# Altium project DSP_FPGA_BOTTOM.PrjPcb (part 1 of 2)
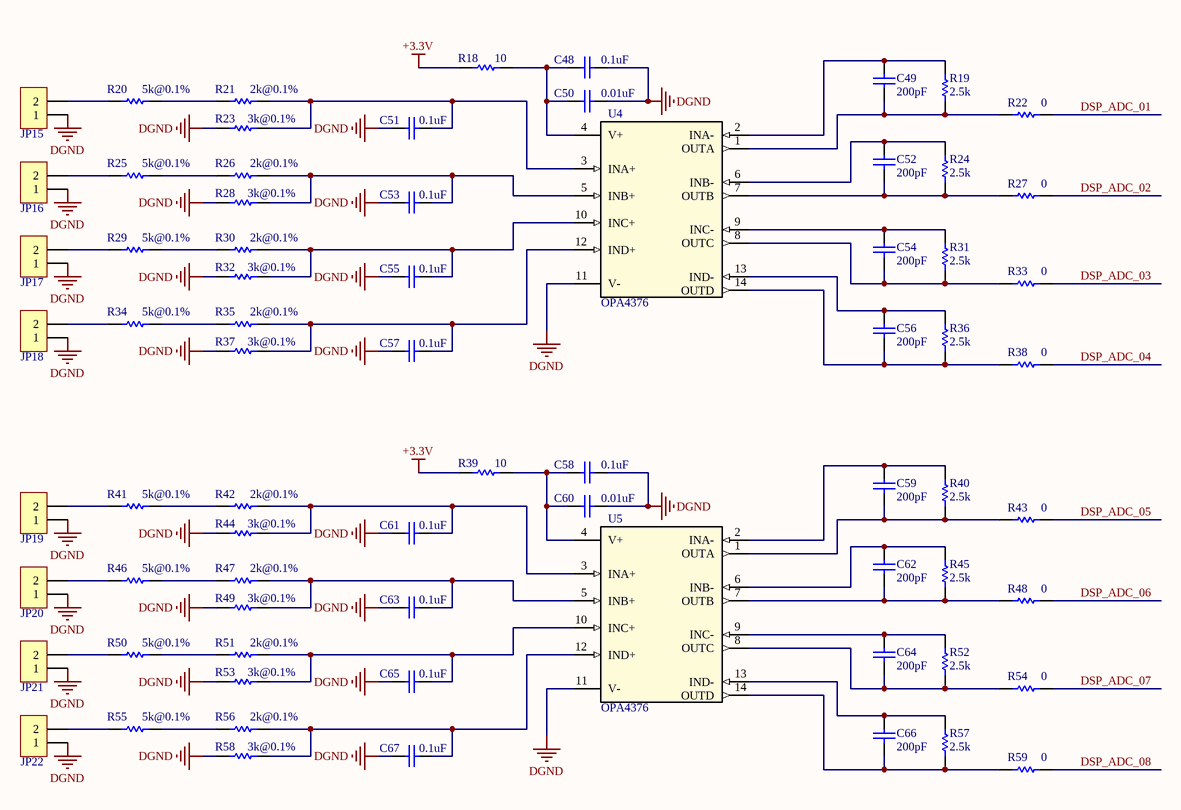
[diagram p0: ADC.SchDoc]
17 sheets, 649 parts. Net scope: global (net labels, ports and power ports of the same name join across sheets).
Board file: DSP_FPGA.PcbDoc
Sheets:
  ADC.SchDoc
  Communication_Part1.SchDoc
  Communication_Part2.SchDoc
  DAC.SchDoc
  DSP_GPIO_Part1.SchDoc
  DSP_GPIO_Part2.SchDoc
  DSP_GPIO_Part3.SchDoc
  DSP_GPIO_Part4.SchDoc
  Enconder_Part1.SchDoc
  Enconder_Part2.SchDoc
  Enconder_Part3.SchDoc
  FPGA_GPIO_Part1.SchDoc
  Header.SchDoc
  Interface_DSP_FPGA.SchDoc
  Power.SchDoc
  PWM_PULSE.SchDoc
  PWM_WIDTH.SchDoc

## Sheet ADC.SchDoc
size A4

### Parts
C48  value 0.1uF  [1608[0603]]  (hidden comment: Cap)
C49  value 200pF  [1608[0603]]  (hidden comment: Cap)
C50  value 0.01uF  [1608[0603]]  (hidden comment: Cap)
C51  value 0.1uF  [1608[0603]]  (hidden comment: Cap)
C52  value 200pF  [1608[0603]]  (hidden comment: Cap)
C53  value 0.1uF  [1608[0603]]  (hidden comment: Cap)
C54  value 200pF  [1608[0603]]  (hidden comment: Cap)
C55  value 0.1uF  [1608[0603]]  (hidden comment: Cap)
C56  value 200pF  [1608[0603]]  (hidden comment: Cap)
C57  value 0.1uF  [1608[0603]]  (hidden comment: Cap)
C58  value 0.1uF  [1608[0603]]  (hidden comment: Cap)
C59  value 200pF  [1608[0603]]  (hidden comment: Cap)
C60  value 0.01uF  [1608[0603]]  (hidden comment: Cap)
C61  value 0.1uF  [1608[0603]]  (hidden comment: Cap)
C62  value 200pF  [1608[0603]]  (hidden comment: Cap)
C63  value 0.1uF  [1608[0603]]  (hidden comment: Cap)
C64  value 200pF  [1608[0603]]  (hidden comment: Cap)
C65  value 0.1uF  [1608[0603]]  (hidden comment: Cap)
C66  value 200pF  [1608[0603]]  (hidden comment: Cap)
C67  value 0.1uF  [1608[0603]]  (hidden comment: Cap)
JP15  HDR-1X2  [MX 1.25-WI-2P]  (value not drawn)
JP16  HDR-1X2  [MX 1.25-WI-2P]  (value not drawn)
JP17  HDR-1X2  [MX 1.25-WI-2P]  (value not drawn)
JP18  HDR-1X2  [MX 1.25-WI-2P]  (value not drawn)
JP19  HDR-1X2  [MX 1.25-WI-2P]  (value not drawn)
JP20  HDR-1X2  [MX 1.25-WI-2P]  (value not drawn)
JP21  HDR-1X2  [MX 1.25-WI-2P]  (value not drawn)
JP22  HDR-1X2  [MX 1.25-WI-2P]  (value not drawn)
R18  value 10  [1608[0603]]  (hidden comment: Res1)
R19  value 2.5k  [1608[0603]]  (hidden comment: Res1)
R20  value 5k@0.1%  [1608[0603]]  (hidden comment: Res1)
R21  value 2k@0.1%  [1608[0603]]  (hidden comment: Res1)
R22  value 0  [1608[0603]]  (hidden comment: Res1)
R23  value 3k@0.1%  [1608[0603]]  (hidden comment: Res1)
R24  value 2.5k  [1608[0603]]  (hidden comment: Res1)
R25  value 5k@0.1%  [1608[0603]]  (hidden comment: Res1)
R26  value 2k@0.1%  [1608[0603]]  (hidden comment: Res1)
R27  value 0  [1608[0603]]  (hidden comment: Res1)
R28  value 3k@0.1%  [1608[0603]]  (hidden comment: Res1)
R29  value 5k@0.1%  [1608[0603]]  (hidden comment: Res1)
R30  value 2k@0.1%  [1608[0603]]  (hidden comment: Res1)
R31  value 2.5k  [1608[0603]]  (hidden comment: Res1)
R32  value 3k@0.1%  [1608[0603]]  (hidden comment: Res1)
R33  value 0  [1608[0603]]  (hidden comment: Res1)
R34  value 5k@0.1%  [1608[0603]]  (hidden comment: Res1)
R35  value 2k@0.1%  [1608[0603]]  (hidden comment: Res1)
R36  value 2.5k  [1608[0603]]  (hidden comment: Res1)
R37  value 3k@0.1%  [1608[0603]]  (hidden comment: Res1)
R38  value 0  [1608[0603]]  (hidden comment: Res1)
R39  value 10  [1608[0603]]  (hidden comment: Res1)
R40  value 2.5k  [1608[0603]]  (hidden comment: Res1)
R41  value 5k@0.1%  [1608[0603]]  (hidden comment: Res1)
R42  value 2k@0.1%  [1608[0603]]  (hidden comment: Res1)
R43  value 0  [1608[0603]]  (hidden comment: Res1)
R44  value 3k@0.1%  [1608[0603]]  (hidden comment: Res1)
R45  value 2.5k  [1608[0603]]  (hidden comment: Res1)
R46  value 5k@0.1%  [1608[0603]]  (hidden comment: Res1)
R47  value 2k@0.1%  [1608[0603]]  (hidden comment: Res1)
R48  value 0  [1608[0603]]  (hidden comment: Res1)
R49  value 3k@0.1%  [1608[0603]]  (hidden comment: Res1)
R50  value 5k@0.1%  [1608[0603]]  (hidden comment: Res1)
R51  value 2k@0.1%  [1608[0603]]  (hidden comment: Res1)
R52  value 2.5k  [1608[0603]]  (hidden comment: Res1)
R53  value 3k@0.1%  [1608[0603]]  (hidden comment: Res1)
R54  value 0  [1608[0603]]  (hidden comment: Res1)
R55  value 5k@0.1%  [1608[0603]]  (hidden comment: Res1)
R56  value 2k@0.1%  [1608[0603]]  (hidden comment: Res1)
R57  value 2.5k  [1608[0603]]  (hidden comment: Res1)
R58  value 3k@0.1%  [1608[0603]]  (hidden comment: Res1)
R59  value 0  [1608[0603]]  (hidden comment: Res1)
U4  OPA4376  [OPA4376_TSSOP]
U5  OPA4376  [OPA4376_TSSOP]

### Nets
+3.3V: R18.2 R39.2
DGND: C48.2 C50.2 C51.1 C53.1 C55.1 C57.1 C58.2 C60.2 C61.1 C63.1 C65.1 C67.1 JP15.1 JP16.1 JP17.1 JP18.1 JP19.1 JP20.1 JP21.1 JP22.1 R23.2 R28.2 R32.2 R37.2 R44.2 R49.2 R53.2 R58.2 U4.11(V-) U5.11(V-)
DSP_ADC_01: R22.2
DSP_ADC_02: R27.2
DSP_ADC_03: R33.2
DSP_ADC_04: R38.2
DSP_ADC_05: R43.2
DSP_ADC_06: R48.2
DSP_ADC_07: R54.2
DSP_ADC_08: R59.2
NetC48_1: C48.1 C50.1 R18.1 U4.4(V+)
NetC49_1: C49.1 R19.2 U4.2(INA-)
NetC49_2: C49.2 R19.1 R22.1 U4.1(OUTA)
NetC51_2: C51.2 R21.1 R23.1 U4.3(INA+)
NetC52_1: C52.1 R24.2 U4.6(INB-)
NetC52_2: C52.2 R24.1 R27.1 U4.7(OUTB)
NetC53_2: C53.2 R26.1 R28.1 U4.5(INB+)
NetC54_1: C54.1 R31.2 U4.9(INC-)
NetC54_2: C54.2 R31.1 R33.1 U4.8(OUTC)
NetC55_2: C55.2 R30.1 R32.1 U4.10(INC+)
NetC56_1: C56.1 R36.2 U4.13(IND-)
NetC56_2: C56.2 R36.1 R38.1 U4.14(OUTD)
NetC57_2: C57.2 R35.1 R37.1 U4.12(IND+)
NetC58_1: C58.1 C60.1 R39.1 U5.4(V+)
NetC59_1: C59.1 R40.2 U5.2(INA-)
NetC59_2: C59.2 R40.1 R43.1 U5.1(OUTA)
NetC61_2: C61.2 R42.1 R44.1 U5.3(INA+)
NetC62_1: C62.1 R45.2 U5.6(INB-)
NetC62_2: C62.2 R45.1 R48.1 U5.7(OUTB)
NetC63_2: C63.2 R47.1 R49.1 U5.5(INB+)
NetC64_1: C64.1 R52.2 U5.9(INC-)
NetC64_2: C64.2 R52.1 R54.1 U5.8(OUTC)
NetC65_2: C65.2 R51.1 R53.1 U5.10(INC+)
NetC66_1: C66.1 R57.2 U5.13(IND-)
NetC66_2: C66.2 R57.1 R59.1 U5.14(OUTD)
NetC67_2: C67.2 R56.1 R58.1 U5.12(IND+)
NetJP15_2: JP15.2 R20.2
NetJP16_2: JP16.2 R25.2
NetJP17_2: JP17.2 R29.2
NetJP18_2: JP18.2 R34.2
NetJP19_2: JP19.2 R41.2
NetJP20_2: JP20.2 R46.2
NetJP21_2: JP21.2 R50.2
NetJP22_2: JP22.2 R55.2
NetR20_1: R20.1 R21.2
NetR25_1: R25.1 R26.2
NetR29_1: R29.1 R30.2
NetR34_1: R34.1 R35.2
NetR41_1: R41.1 R42.2
NetR46_1: R46.1 R47.2
NetR50_1: R50.1 R51.2
NetR55_1: R55.1 R56.2

### Library data of the parts
C48-C67 = Cap: Capacitor; Published: 8-Jun-2000; LatestRevisionDate: 17-Jul-2002; LatestRevisionNote: Re-released for DXP Platform.; PackageReference: RAD-0.3; Publisher: Altium Limited; PackageDescription: Radial Cap, Thru-Hole; 2 Leads; 0.3 in Pin Spacing
JP15-JP22 = Header 2: 2P接插件; 版权归属: 源创客; BOM名称: 2P接插件; 学习资源: www.ooocke.com
R18-R59 = Res1: Resistor; Published: 8-Jun-2000; LatestRevisionDate: 17-Jul-2002; LatestRevisionNote: Re-released for DXP Platform.; PackageReference: AXIAL-0.3; Publisher: Altium Limited; PackageDescription: Axial Device, Thru-Hole; 2 Leads; 0.3 in Pin Spacing
U4 U5 = OPA4376: Manufacturer: Texas Instruments; Manufacturer_Part_Number: opa4376_pw_14; INDUSTRY_STD_PKG_TYPE: TSSOP; FAMILY_NAME: LOW OFFSET VOLTAGE; PIN_COUNT: 14; PACKAGE_DESIGNATOR: PW; Datasheet_URL: http://www.ti.com/lit/gpn/OPA4376; GENERIC_PART_NUMBER: OPA4376; Vendor: Texas Instruments; Value: Value; Type: Type; RefDes: RefDes

## Sheet Communication_Part1.SchDoc
size A4
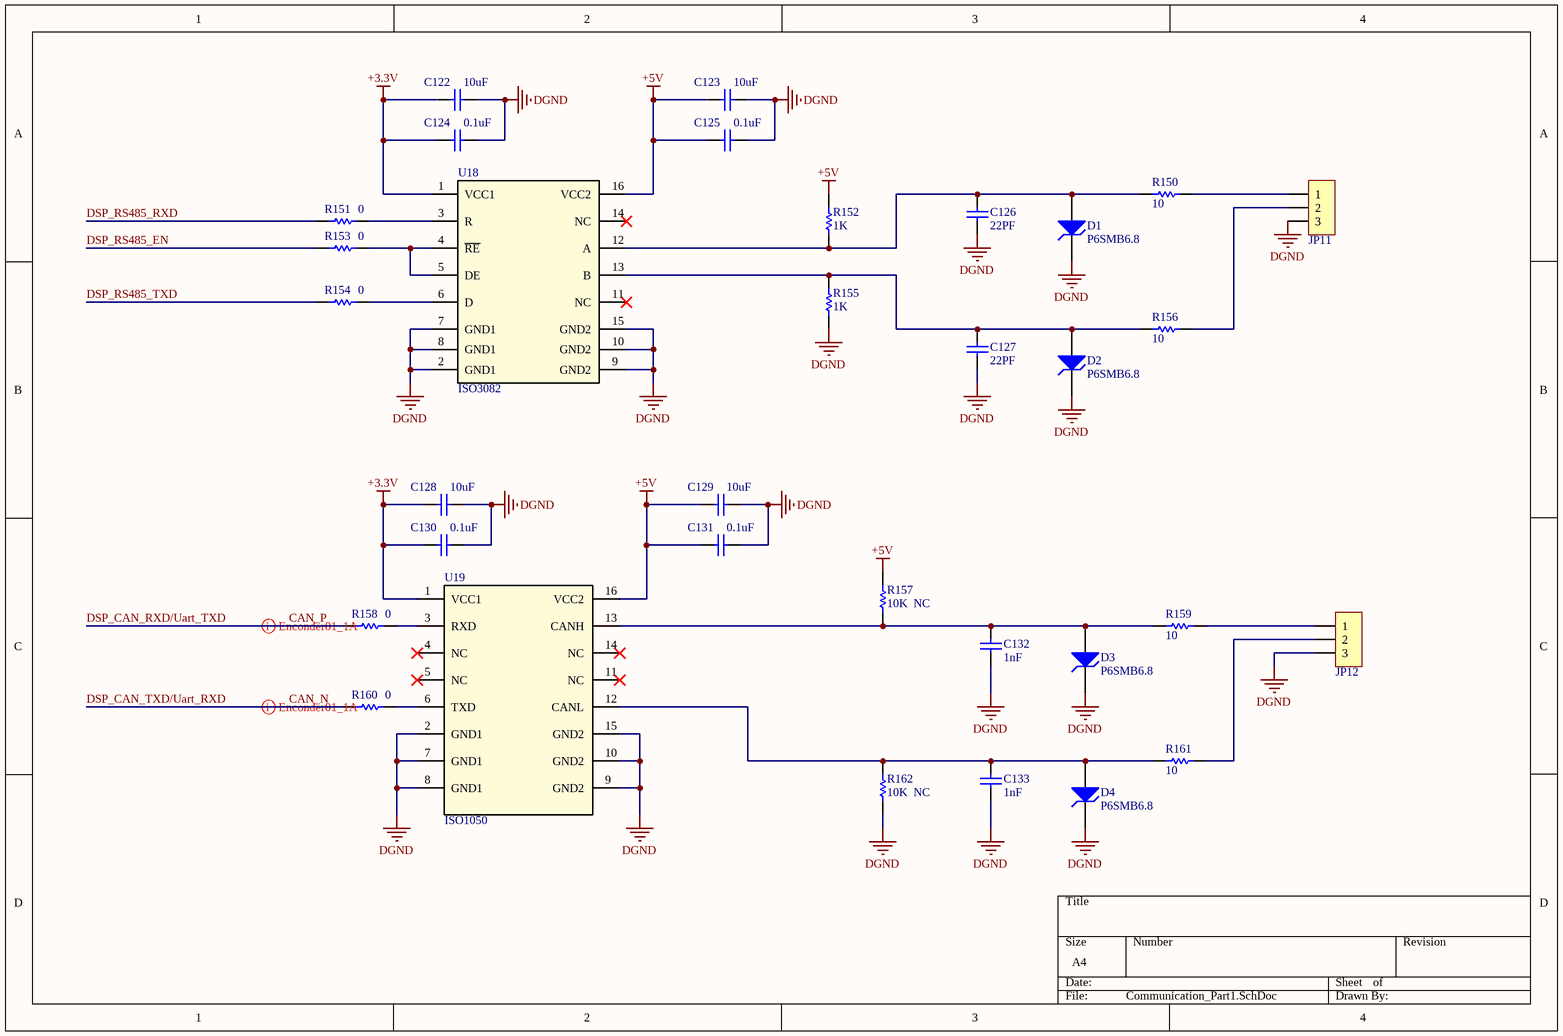
[diagram p1: Communication_Part1.SchDoc]

### Parts
C122  value 10uF  [1608[0603]]  (hidden comment: Cap)
C123  value 10uF  [1608[0603]]  (hidden comment: Cap)
C124  value 0.1uF  [1608[0603]]  (hidden comment: Cap)
C125  value 0.1uF  [1608[0603]]  (hidden comment: Cap)
C126  value 22PF  [1608[0603]]  (hidden comment: Cap)
C127  value 22PF  [1608[0603]]  (hidden comment: Cap)
C128  value 10uF  [1608[0603]]  (hidden comment: Cap)
C129  value 10uF  [1608[0603]]  (hidden comment: Cap)
C130  value 0.1uF  [1608[0603]]  (hidden comment: Cap)
C131  value 0.1uF  [1608[0603]]  (hidden comment: Cap)
C132  value 1nF  [1608[0603]]  (hidden comment: Cap)
C133  value 1nF  [1608[0603]]  (hidden comment: Cap)
D1  P6SMB6.8  [DIODE_SMC]
D2  P6SMB6.8  [DIODE_SMC]
D3  P6SMB6.8  [DIODE_SMC]
D4  P6SMB6.8  [DIODE_SMC]
JP11  HDR-1X3  [ZH1.5-WI-3P]  (value not drawn)
JP12  HDR-1X3  [ZH1.5-WI-3P]  (value not drawn)
R150  value 10  [1608[0603]]  (hidden comment: Res1)
R151  value 0  [1608[0603]]  (hidden comment: Res1)
R152  value 1K  [1608[0603]]  (hidden comment: Res1)
R153  value 0  [1608[0603]]  (hidden comment: Res1)
R154  value 0  [1608[0603]]  (hidden comment: Res1)
R155  value 1K  [1608[0603]]  (hidden comment: Res1)
R156  value 10  [1608[0603]]  (hidden comment: Res1)
R157  value 10K  NC  [1608[0603]]  (hidden comment: Res1)
R158  value 0  [1608[0603]]  (hidden comment: Res1)
R159  value 10  [1608[0603]]  (hidden comment: Res1)
R160  value 0  [1608[0603]]  (hidden comment: Res1)
R161  value 10  [1608[0603]]  (hidden comment: Res1)
R162  value 10K  NC  [1608[0603]]  (hidden comment: Res1)
U18  ISO3082  [ISO3082_SOIC]
U19  ISO1050  [ISO1050_SOIC]

### Nets
+3.3V: C122.2 C124.2 C128.2 C130.2 U18.1(VCC1) U19.1(VCC1)
+5V: C123.2 C125.2 C129.2 C131.2 R152.2 R157.2 U18.16(VCC2) U19.16(VCC2)
DGND: C122.1 C123.1 C124.1 C125.1 C126.2 C127.2 C128.1 C129.1 C130.1 C131.1 C132.2 C133.2 D1.1(K) D2.1(K) D3.1(K) D4.1(K) JP11.3 JP12.3 R155.1 R162.1 U18.2(GND1) U18.7(GND1) U18.8(GND1) U18.9(GND2) U18.10(GND2) U18.15(GND2) U19.2(GND1) U19.7(GND1) U19.8(GND1) U19.9(GND2) U19.10(GND2) U19.15(GND2)
CAN_N: R160.1  [also labelled DSP_CAN_TXD/Uart_RXD]
CAN_P: R158.1  [also labelled DSP_CAN_RXD/Uart_TXD]
DSP_RS485_EN: R153.1
DSP_RS485_RXD: R151.1
DSP_RS485_TXD: R154.1
NetC126_1: C126.1 D1.2(A) R150.2 R152.1 U18.12(A)
NetC127_1: C127.1 D2.2(A) R155.2 R156.2 U18.13(B)
NetC132_1: C132.1 D3.2(A) R157.1 R159.2 U19.13(CANH)
NetC133_1: C133.1 D4.2(A) R161.2 R162.2 U19.12(CANL)
NetJP11_1: JP11.1 R150.1
NetJP11_2: JP11.2 R156.1
NetJP12_1: JP12.1 R159.1
NetJP12_2: JP12.2 R161.1
NetR151_2: R151.2 U18.3(R)
NetR153_2: R153.2 U18.4(~{RE}) U18.5(DE)
NetR154_2: R154.2 U18.6(D)
NetR158_2: R158.2 U19.3(RXD)
NetR160_2: R160.2 U19.6(TXD)

Not connected (* = marked no-connect by the designer): U18 11(NC)* 14(NC)*; U19 4(NC)* 5(NC)* 11(NC)* 14(NC)*

### Layout directives
differential pair: CAN_N, CAN_P

### Library data of the parts
C122-C133 = Cap: Capacitor; Published: 8-Jun-2000; LatestRevisionDate: 17-Jul-2002; LatestRevisionNote: Re-released for DXP Platform.; PackageReference: RAD-0.3; Publisher: Altium Limited; PackageDescription: Radial Cap, Thru-Hole; 2 Leads; 0.3 in Pin Spacing
D1-D4 = MMSZ56T1: Surface Mount Silicon Zener Diode; Published: 29-Sep-2000; LatestRevisionDate: 19-Mar-2004; LatestRevisionNote: Silkscreen size reduced; PCB footprint pad transposed.; PackageVersion: 1988; PackageReference: 425; Publisher: Altium Limited; PackageDescription: SOD-123; 2 Leads; Body 2.7 x 1.6 mm, (LxW); ComponentLink1Description: Manufacturer Link; ComponentLink1URL: http://www.onsemi.com/site/products/landing?taxonomyID=194; ComponentLink2Description: Datasheet; ComponentLink2URL: http://www.onsemi.com/pub/Collateral/MMSZ2V4T1-D.PDF
JP11 JP12 = Header 3: 3P接插件; 版权归属: 源创客; BOM名称: 3P接插件; 学习资源: www.ooocke.com
R150-R162 = Res1: Resistor; Published: 8-Jun-2000; LatestRevisionDate: 17-Jul-2002; LatestRevisionNote: Re-released for DXP Platform.; PackageReference: AXIAL-0.3; Publisher: Altium Limited; PackageDescription: Axial Device, Thru-Hole; 2 Leads; 0.3 in Pin Spacing
U18 = ISO3082: Manufacturer: Texas Instruments; Manufacturer_Part_Number: iso3082_dw_16; INDUSTRY_STD_PKG_TYPE: SOIC; FAMILY_NAME: ISOLATOR; PIN_COUNT: 16; PACKAGE_DESIGNATOR: DW; Datasheet_URL: http://www.ti.com/lit/gpn/ISO3082; GENERIC_PART_NUMBER: ISO3082; Vendor: Texas Instruments; Value: Value; Type: Type; RefDes: RefDes
U19 = ISO1050: Manufacturer: Texas Instruments; Manufacturer_Part_Number: iso1050_dw_16; INDUSTRY_STD_PKG_TYPE: SOIC; FAMILY_NAME: ISOLATOR; PIN_COUNT: 16; PACKAGE_DESIGNATOR: DW; Datasheet_URL: http://www.ti.com/lit/gpn/ISO1050; GENERIC_PART_NUMBER: ISO1050; Vendor: Texas Instruments; Value: Value; Type: Type; RefDes: RefDes

## Sheet Communication_Part2.SchDoc
size A4
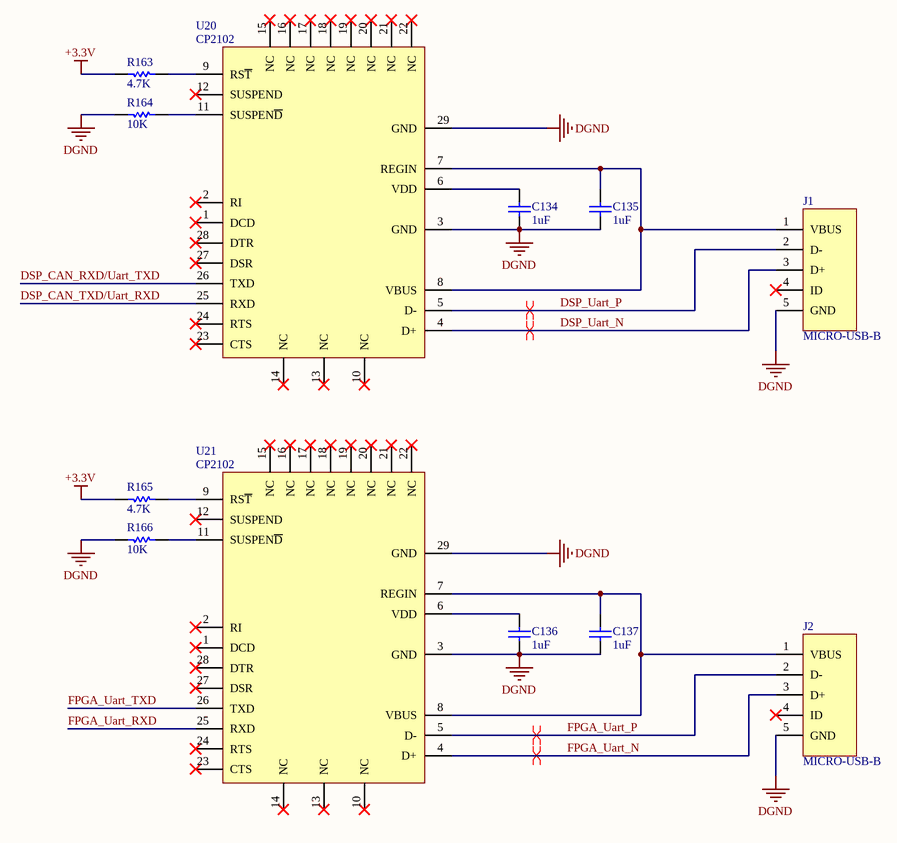
[diagram p2: Communication_Part2.SchDoc]

### Parts
C134  value 1uF  [1608[0603]]  (hidden comment: Cap)
C135  value 1uF  [1608[0603]]  (hidden comment: Cap)
C136  value 1uF  [1608[0603]]  (hidden comment: Cap)
C137  value 1uF  [1608[0603]]  (hidden comment: Cap)
J1  MICRO-USB-B  [MICRO-USB-B]
J2  MICRO-USB-B  [MICRO-USB-B]
R163  value 4.7K  [1608[0603]]  (hidden comment: Res1)
R164  value 10K  [1608[0603]]  (hidden comment: Res1)
R165  value 4.7K  [1608[0603]]  (hidden comment: Res1)
R166  value 10K  [1608[0603]]  (hidden comment: Res1)
U20  CP2102  [CP2102_QFN28]
U21  CP2102  [CP2102_QFN28]

### Nets
+3.3V: R163.1 R165.1
DGND: C134.2 C135.2 C136.2 C137.2 J1.5(GND) J2.5(GND) R164.1 R166.1 U20.3(GND) U20.29(GND) U21.3(GND) U21.29(GND)
DSP_CAN_RXD/Uart_TXD: U20.26(TXD)  [project net CAN_P]
DSP_CAN_TXD/Uart_RXD: U20.25(RXD)  [project net CAN_N]
DSP_Uart_N: J1.3(D+) U20.4(D+)
DSP_Uart_P: J1.2(D-) U20.5(D-)
FPGA_Uart_N: J2.3(D+) U21.4(D+)
FPGA_Uart_P: J2.2(D-) U21.5(D-)
FPGA_Uart_RXD: U21.25(RXD)
FPGA_Uart_TXD: U21.26(TXD)
NetC134_1: C134.1 U20.6(VDD)
NetC135_1: C135.1 J1.1(VBUS) U20.7(REGIN) U20.8(VBUS)
NetC136_1: C136.1 U21.6(VDD)
NetC137_1: C137.1 J2.1(VBUS) U21.7(REGIN) U21.8(VBUS)
NetR163_2: R163.2 U20.9(RS~{T})
NetR164_2: R164.2 U20.11(SUSPEN~{D})
NetR165_2: R165.2 U21.9(RS~{T})
NetR166_2: R166.2 U21.11(SUSPEN~{D})

Not connected (* = marked no-connect by the designer): J1 4(ID)*; J2 4(ID)*; U20 1(DCD)* 2(RI)* 10(NC)* 12(SUSPEND)* 13(NC)* 14(NC)* 15(NC)* 16(NC)* 17(NC)* 18(NC)* 19(NC)* 20(NC)* 21(NC)* 22(NC)* 23(CTS)* 24(RTS)* 27(DSR)* 28(DTR)*; U21 1(DCD)* 2(RI)* 10(NC)* 12(SUSPEND)* 13(NC)* 14(NC)* 15(NC)* 16(NC)* 17(NC)* 18(NC)* 19(NC)* 20(NC)* 21(NC)* 22(NC)* 23(CTS)* 24(RTS)* 27(DSR)* 28(DTR)*

### Layout directives
differential pair: DSP_Uart_N, DSP_Uart_P, FPGA_Uart_N, FPGA_Uart_P

### Library data of the parts
C134-C137 = Cap: Capacitor; Published: 8-Jun-2000; LatestRevisionDate: 17-Jul-2002; LatestRevisionNote: Re-released for DXP Platform.; PackageReference: RAD-0.3; Publisher: Altium Limited; PackageDescription: Radial Cap, Thru-Hole; 2 Leads; 0.3 in Pin Spacing
R163-R166 = Res1: Resistor; Published: 8-Jun-2000; LatestRevisionDate: 17-Jul-2002; LatestRevisionNote: Re-released for DXP Platform.; PackageReference: AXIAL-0.3; Publisher: Altium Limited; PackageDescription: Axial Device, Thru-Hole; 2 Leads; 0.3 in Pin Spacing
U20 U21 = CP2102: PART_DESC: SINGLE-CHIP USB TO UART BRIDGE, QFN28, RoHS.; MFG_#1: SILICON LABS; PART_NUMBER: CP2102; VALUE: CP2102; Type: Type; RefDes: RefDes

## Sheet DAC.SchDoc
size A4
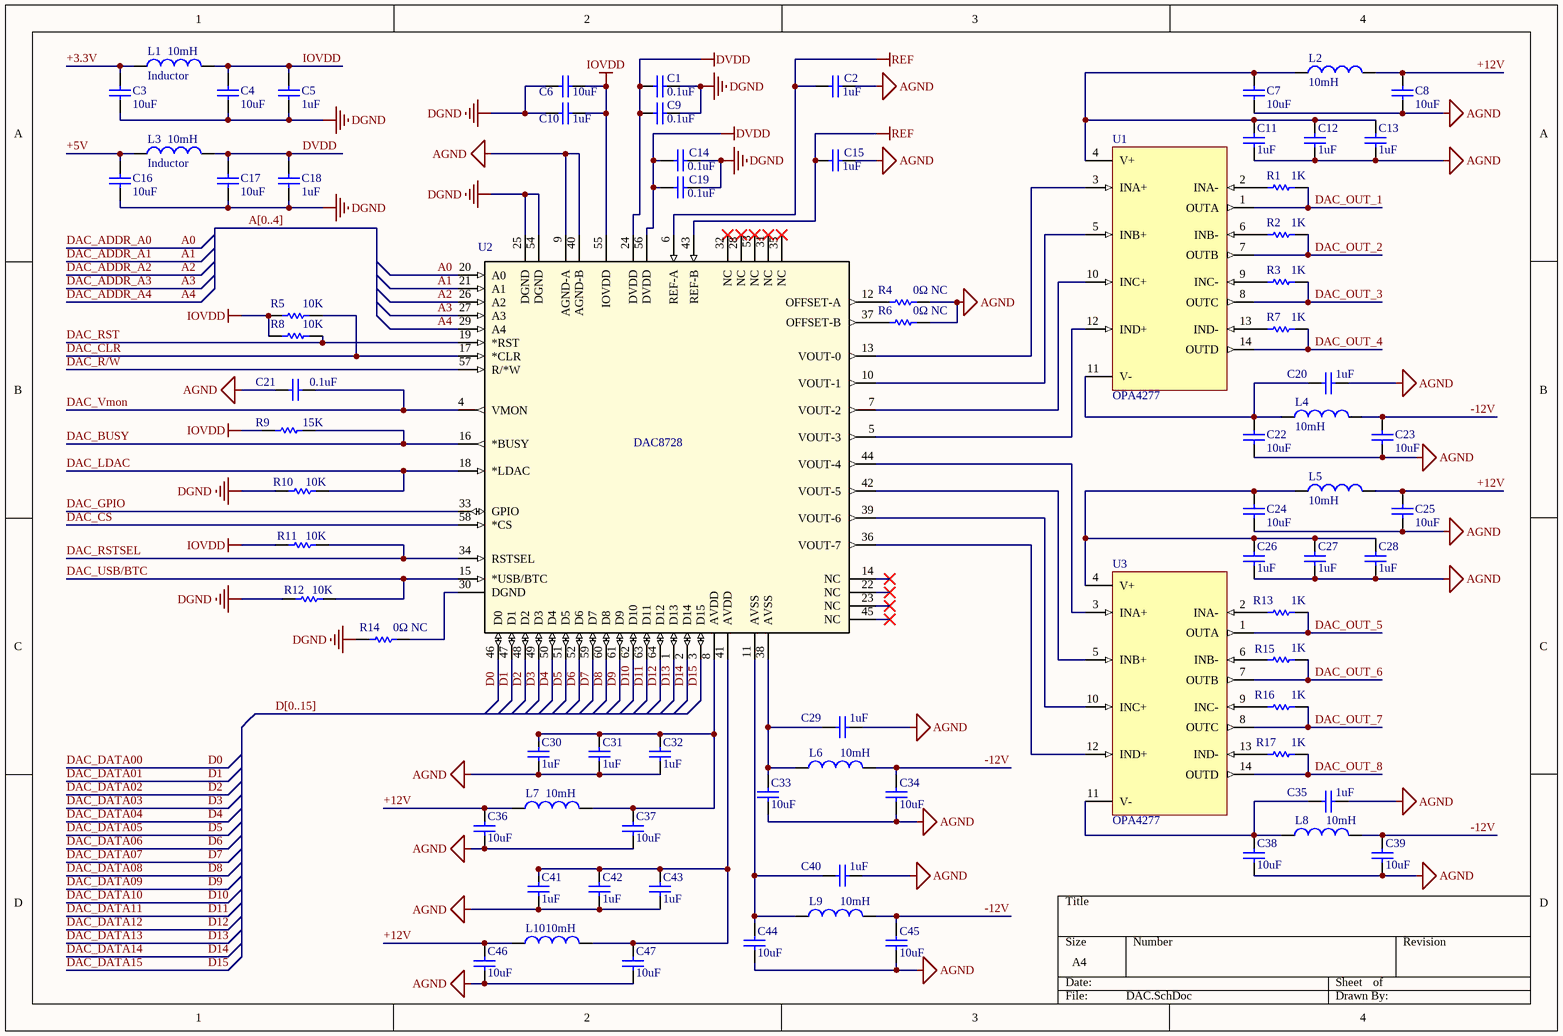
[diagram p3: DAC.SchDoc]

### Parts
C1  value 0.1uF  [1608[0603]]  (hidden comment: Cap)
C2  value 1uF  [1608[0603]]  (hidden comment: Cap)
C3  value 10uF  [1608[0603]]  (hidden comment: Cap)
C4  value 10uF  [1608[0603]]  (hidden comment: Cap)
C5  value 1uF  [1608[0603]]  (hidden comment: Cap)
C6  value 10uF  [1608[0603]]  (hidden comment: Cap)
C7  value 10uF  [1608[0603]]  (hidden comment: Cap)
C8  value 10uF  [1608[0603]]  (hidden comment: Cap)
C9  value 0.1uF  [1608[0603]]  (hidden comment: Cap)
C10  value 1uF  [1608[0603]]  (hidden comment: Cap)
C11  value 1uF  [1608[0603]]  (hidden comment: Cap)
C12  value 1uF  [1608[0603]]  (hidden comment: Cap)
C13  value 1uF  [1608[0603]]  (hidden comment: Cap)
C14  value 0.1uF  [1608[0603]]  (hidden comment: Cap)
C15  value 1uF  [1608[0603]]  (hidden comment: Cap)
C16  value 10uF  [1608[0603]]  (hidden comment: Cap)
C17  value 10uF  [1608[0603]]  (hidden comment: Cap)
C18  value 1uF  [1608[0603]]  (hidden comment: Cap)
C19  value 0.1uF  [1608[0603]]  (hidden comment: Cap)
C20  value 1uF  [1608[0603]]  (hidden comment: Cap)
C21  value 0.1uF  [1608[0603]]  (hidden comment: Cap)
C22  value 10uF  [1608[0603]]  (hidden comment: Cap)
C23  value 10uF  [1608[0603]]  (hidden comment: Cap)
C24  value 10uF  [1608[0603]]  (hidden comment: Cap)
C25  value 10uF  [1608[0603]]  (hidden comment: Cap)
C26  value 1uF  [1608[0603]]  (hidden comment: Cap)
C27  value 1uF  [1608[0603]]  (hidden comment: Cap)
C28  value 1uF  [1608[0603]]  (hidden comment: Cap)
C29  value 1uF  [1608[0603]]  (hidden comment: Cap)
C30  value 1uF  [1608[0603]]  (hidden comment: Cap)
C31  value 1uF  [1608[0603]]  (hidden comment: Cap)
C32  value 1uF  [1608[0603]]  (hidden comment: Cap)
C33  value 10uF  [1608[0603]]  (hidden comment: Cap)
C34  value 10uF  [1608[0603]]  (hidden comment: Cap)
C35  value 1uF  [1608[0603]]  (hidden comment: Cap)
C36  value 10uF  [1608[0603]]  (hidden comment: Cap)
C37  value 10uF  [1608[0603]]  (hidden comment: Cap)
C38  value 10uF  [1608[0603]]  (hidden comment: Cap)
C39  value 10uF  [1608[0603]]  (hidden comment: Cap)
C40  value 1uF  [1608[0603]]  (hidden comment: Cap)
C41  value 1uF  [1608[0603]]  (hidden comment: Cap)
C42  value 1uF  [1608[0603]]  (hidden comment: Cap)
C43  value 1uF  [1608[0603]]  (hidden comment: Cap)
C44  value 10uF  [1608[0603]]  (hidden comment: Cap)
C45  value 10uF  [1608[0603]]  (hidden comment: Cap)
C46  value 10uF  [1608[0603]]  (hidden comment: Cap)
C47  value 10uF  [1608[0603]]  (hidden comment: Cap)
L1  Inductor  value 10mH  [2029]
L2  value 10mH  [2029]  (hidden comment: Inductor)
L3  Inductor  value 10mH  [2029]
L4  value 10mH  [2029]  (hidden comment: Inductor)
L5  value 10mH  [2029]  (hidden comment: Inductor)
L6  value 10mH  [2029]  (hidden comment: Inductor)
L7  value 10mH  [2029]  (hidden comment: Inductor)
L8  value 10mH  [2029]  (hidden comment: Inductor)
L9  value 10mH  [2029]  (hidden comment: Inductor)
L10  value 10mH  [2029]  (hidden comment: Inductor)
R1  value 1K  [1608[0603]]  (hidden comment: Res1)
R2  value 1K  [1608[0603]]  (hidden comment: Res1)
R3  value 1K  [1608[0603]]  (hidden comment: Res1)
R4  value 0Ω NC  [1608[0603]]  (hidden comment: Res1)
R5  value 10K  [1608[0603]]  (hidden comment: Res1)
R6  value 0Ω NC  [1608[0603]]  (hidden comment: Res1)
R7  value 1K  [1608[0603]]  (hidden comment: Res1)
R8  value 10K  [1608[0603]]  (hidden comment: Res1)
R9  value 15K  [1608[0603]]  (hidden comment: Res1)
R10  value 10K  [1608[0603]]  (hidden comment: Res1)
R11  value 10K  [1608[0603]]  (hidden comment: Res1)
R12  value 10K  [1608[0603]]  (hidden comment: Res1)
R13  value 1K  [1608[0603]]  (hidden comment: Res1)
R14  value 0Ω NC  [1608[0603]]  (hidden comment: Res1)
R15  value 1K  [1608[0603]]  (hidden comment: Res1)
R16  value 1K  [1608[0603]]  (hidden comment: Res1)
R17  value 1K  [1608[0603]]  (hidden comment: Res1)
U1  OPA4277  [OPA4277_SOIC]
U2  DAC8728  [DAC8728]
U3  OPA4277  [OPA4277_SOIC]

### Nets
+3.3V: C3.2 L1.1
+5V: C16.2 L3.1
AGND: C2.1 C7.2 C8.2 C11.2 C12.2 C13.2 C15.1 C20.2 C21.2 C22.2 C23.2 C24.2 C25.2 C26.2 C27.2 C28.2 C29.2 C30.2 C31.2 C32.2 C33.2 C34.2 C35.2 C36.2 C37.2 C38.2 C39.2 C40.2 C41.2 C42.2 C43.2 C44.2 C45.2 C46.2 C47.2 R4.2 R6.2 U2.9(AGND-A) U2.40(AGND-B)
DGND: C1.2 C3.1 C4.1 C5.1 C6.1 C9.1 C10.2 C14.2 C16.1 C17.1 C18.1 C19.1 R10.2 R12.2 R14.1 U2.25(DGND) U2.54(DGND)
DVDD: C1.1 C9.2 C14.1 C17.2 C18.2 C19.2 L3.2 U2.24(DVDD) U2.56(DVDD)
IOVDD: C4.2 C5.2 C6.2 C10.1 L1.2 R5.1 R8.1 R9.2 R11.2 U2.55(IOVDD)
REF: C2.2 C15.2 U2.6(REF-A) U2.43(REF-B)
+12V: C8.1 C25.1 C36.1 C46.1 L2.1 L5.1 L7.1 L10.1
-12V: C23.1 C34.1 C39.1 C45.1 L4.2 L6.2 L8.2 L9.2
A0: U2.20(A0)  [also labelled DAC_ADDR_A0]
A1: U2.21(A1)  [also labelled DAC_ADDR_A1]
A2: U2.26(A2)  [also labelled DAC_ADDR_A2]
A3: U2.27(A3)  [also labelled DAC_ADDR_A3]
A4: U2.29(A4)  [also labelled DAC_ADDR_A4]
D0: U2.46(D0)  [also labelled DAC_DATA00]
D1: U2.47(D1)  [also labelled DAC_DATA01]
D2: U2.48(D2)  [also labelled DAC_DATA02]
D3: U2.49(D3)  [also labelled DAC_DATA03]
D4: U2.50(D4)  [also labelled DAC_DATA04]
D5: U2.51(D5)  [also labelled DAC_DATA05]
D6: U2.52(D6)  [also labelled DAC_DATA06]
D7: U2.59(D7)  [also labelled DAC_DATA07]
D8: U2.60(D8)  [also labelled DAC_DATA08]
D9: U2.61(D9)  [also labelled DAC_DATA09]
D10: U2.62(D10)  [also labelled DAC_DATA10]
D11: U2.63(D11)  [also labelled DAC_DATA11]
D12: U2.64(D12)  [also labelled DAC_DATA12]
D13: U2.1(D13)  [also labelled DAC_DATA13]
D14: U2.2(D14)  [also labelled DAC_DATA14]
D15: U2.3(D15)  [also labelled DAC_DATA15]
DAC_BUSY: R9.1 U2.16(*BUSY)
DAC_CLR: R5.2 U2.17(*CLR)
DAC_CS: U2.58(*CS)
DAC_GPIO: U2.33(GPIO)
DAC_LDAC: R10.1 U2.18(*LDAC)
DAC_OUT_1: R1.2 U1.1(OUTA)
DAC_OUT_2: R2.2 U1.7(OUTB)
DAC_OUT_3: R3.2 U1.8(OUTC)
DAC_OUT_4: R7.2 U1.14(OUTD)
DAC_OUT_5: R13.2 U3.1(OUTA)
DAC_OUT_6: R15.2 U3.7(OUTB)
DAC_OUT_7: R16.2 U3.8(OUTC)
DAC_OUT_8: R17.2 U3.14(OUTD)
DAC_R/W: U2.57(R/*W)
DAC_RST: R8.2 U2.19(*RST)
DAC_RSTSEL: R11.1 U2.34(RSTSEL)
DAC_USB/BTC: R12.1 U2.15(*USB/BTC)
DAC_Vmon: C21.1 U2.4(VMON)
NetC7_1: C7.1 C11.1 C12.1 C13.1 L2.2 U1.4(V+)
NetC20_1: C20.1 C22.1 L4.1 U1.11(V-)
NetC24_1: C24.1 C26.1 C27.1 C28.1 L5.2 U3.4(V+)
NetC29_1: C29.1 C33.1 L6.1 U2.38(AVSS)
NetC30_1: C30.1 C31.1 C32.1 C37.1 L7.2 U2.8(AVDD)
NetC35_1: C35.1 C38.1 L8.1 U3.11(V-)
NetC40_1: C40.1 C44.1 L9.1 U2.11(AVSS)
NetC41_1: C41.1 C42.1 C43.1 C47.1 L10.2 U2.41(AVDD)
NetR1_1: R1.1 U1.2(INA-)
NetR2_1: R2.1 U1.6(INB-)
NetR3_1: R3.1 U1.9(INC-)
NetR4_1: R4.1 U2.12(OFFSET-A)
NetR6_1: R6.1 U2.37(OFFSET-B)
NetR7_1: R7.1 U1.13(IND-)
NetR13_1: R13.1 U3.2(INA-)
NetR14_2: R14.2 U2.30(DGND)
NetR15_1: R15.1 U3.6(INB-)
NetR16_1: R16.1 U3.9(INC-)
NetR17_1: R17.1 U3.13(IND-)
NetU1_3: U1.3(INA+) U2.13(VOUT-0)
NetU1_5: U1.5(INB+) U2.10(VOUT-1)
NetU1_10: U1.10(INC+) U2.7(VOUT-2)
NetU1_12: U1.12(IND+) U2.5(VOUT-3)
NetU2_36: U2.36(VOUT-7) U3.12(IND+)
NetU2_39: U2.39(VOUT-6) U3.10(INC+)
NetU2_42: U2.42(VOUT-5) U3.5(INB+)
NetU2_44: U2.44(VOUT-4) U3.3(INA+)

Not connected (* = marked no-connect by the designer): U2 14(NC)* 22(NC)* 23(NC)* 28(NC)* 31(NC)* 32(NC)* 35(NC)* 45(NC)* 53(NC)*

### Buses and harness runs
bus A[0..4]
bus D[0..15]

### Library data of the parts
C1-C47 = Cap: Capacitor; Published: 8-Jun-2000; LatestRevisionDate: 17-Jul-2002; LatestRevisionNote: Re-released for DXP Platform.; PackageReference: RAD-0.3; Publisher: Altium Limited; PackageDescription: Radial Cap, Thru-Hole; 2 Leads; 0.3 in Pin Spacing
L1-L10 = Inductor: Code_IEC: 1005; Published: 8-Jun-2000; LatestRevisionDate: 29-May-2009; LatestRevisionNote: IPC-7351 Footprint Added.; PackageReference: 0402-A; Publisher: Altium Limited; PackageDescription: Chip Inductor; Code_JEITA: 0402
R1-R17 = Res1: Resistor; Published: 8-Jun-2000; LatestRevisionDate: 17-Jul-2002; LatestRevisionNote: Re-released for DXP Platform.; PackageReference: AXIAL-0.3; Publisher: Altium Limited; PackageDescription: Axial Device, Thru-Hole; 2 Leads; 0.3 in Pin Spacing

## Sheet DSP_GPIO_Part1.SchDoc
size A4
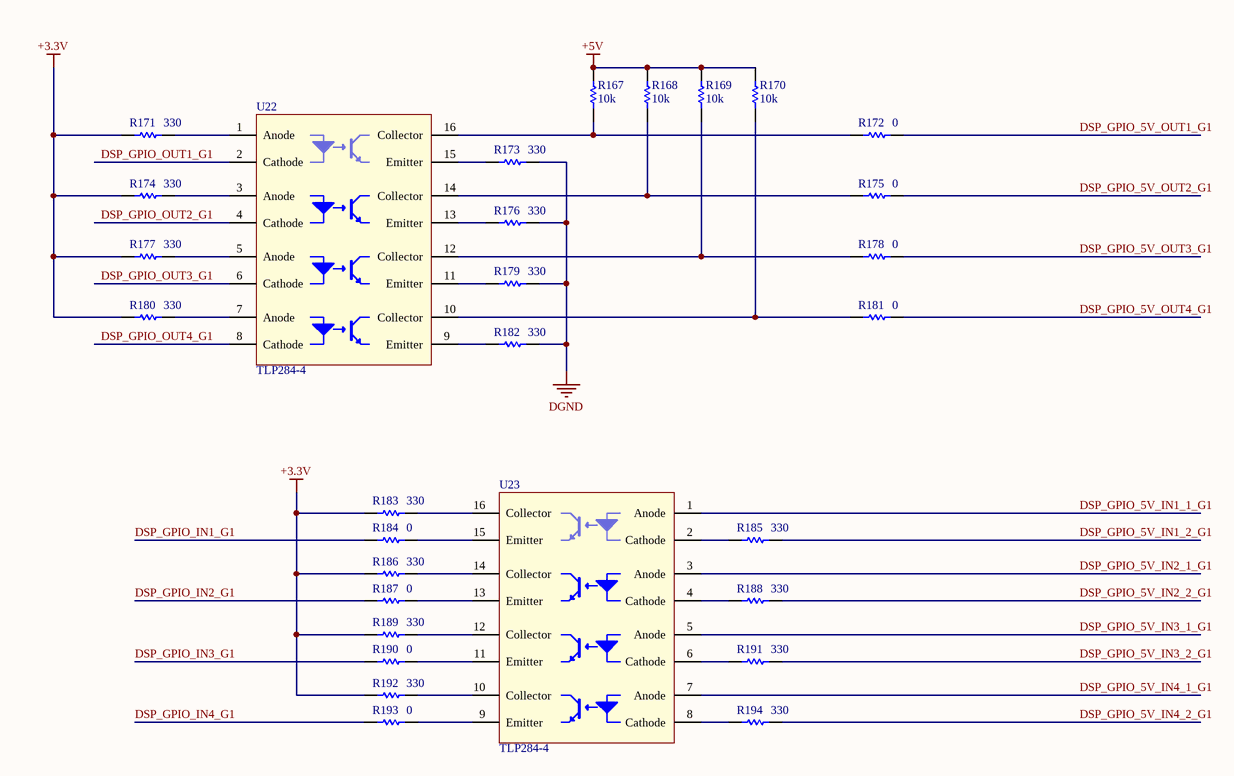
[diagram p4: DSP_GPIO_Part1.SchDoc]

### Parts
R167  value 10k  [1608[0603]]  (hidden comment: Res1)
R168  value 10k  [1608[0603]]  (hidden comment: Res1)
R169  value 10k  [1608[0603]]  (hidden comment: Res1)
R170  value 10k  [1608[0603]]  (hidden comment: Res1)
R171  value 330  [1608[0603]]  (hidden comment: Res1)
R172  value 0  [1608[0603]]  (hidden comment: Res1)
R173  value 330  [1608[0603]]  (hidden comment: Res1)
R174  value 330  [1608[0603]]  (hidden comment: Res1)
R175  value 0  [1608[0603]]  (hidden comment: Res1)
R176  value 330  [1608[0603]]  (hidden comment: Res1)
R177  value 330  [1608[0603]]  (hidden comment: Res1)
R178  value 0  [1608[0603]]  (hidden comment: Res1)
R179  value 330  [1608[0603]]  (hidden comment: Res1)
R180  value 330  [1608[0603]]  (hidden comment: Res1)
R181  value 0  [1608[0603]]  (hidden comment: Res1)
R182  value 330  [1608[0603]]  (hidden comment: Res1)
R183  value 330  [1608[0603]]  (hidden comment: Res1)
R184  value 0  [1608[0603]]  (hidden comment: Res1)
R185  value 330  [1608[0603]]  (hidden comment: Res1)
R186  value 330  [1608[0603]]  (hidden comment: Res1)
R187  value 0  [1608[0603]]  (hidden comment: Res1)
R188  value 330  [1608[0603]]  (hidden comment: Res1)
R189  value 330  [1608[0603]]  (hidden comment: Res1)
R190  value 0  [1608[0603]]  (hidden comment: Res1)
R191  value 330  [1608[0603]]  (hidden comment: Res1)
R192  value 330  [1608[0603]]  (hidden comment: Res1)
R193  value 0  [1608[0603]]  (hidden comment: Res1)
R194  value 330  [1608[0603]]  (hidden comment: Res1)
U22  TLP284-4  [TLP284-4]
U23  TLP284-4  [TLP284-4]

### Nets
+3.3V: R171.1 R174.1 R177.1 R180.1 R183.1 R186.1 R189.1 R192.1
+5V: R167.2 R168.2 R169.2 R170.2
DGND: R173.2 R176.2 R179.2 R182.2
DSP_GPIO_5V_IN1_1_G1: U23.1(Anode)
DSP_GPIO_5V_IN1_2_G1: R185.2
DSP_GPIO_5V_IN2_1_G1: U23.3(Anode)
DSP_GPIO_5V_IN2_2_G1: R188.2
DSP_GPIO_5V_IN3_1_G1: U23.5(Anode)
DSP_GPIO_5V_IN3_2_G1: R191.2
DSP_GPIO_5V_IN4_1_G1: U23.7(Anode)
DSP_GPIO_5V_IN4_2_G1: R194.2
DSP_GPIO_5V_OUT1_G1: R172.2
DSP_GPIO_5V_OUT2_G1: R175.2
DSP_GPIO_5V_OUT3_G1: R178.2
DSP_GPIO_5V_OUT4_G1: R181.2
DSP_GPIO_IN1_G1: R184.1
DSP_GPIO_IN2_G1: R187.1
DSP_GPIO_IN3_G1: R190.1
DSP_GPIO_IN4_G1: R193.1
DSP_GPIO_OUT1_G1: U22.2(Cathode)
DSP_GPIO_OUT2_G1: U22.4(Cathode)
DSP_GPIO_OUT3_G1: U22.6(Cathode)
DSP_GPIO_OUT4_G1: U22.8(Cathode)
NetR167_1: R167.1 R172.1 U22.16(Collector)
NetR168_1: R168.1 R175.1 U22.14(Collector)
NetR169_1: R169.1 R178.1 U22.12(Collector)
NetR170_1: R170.1 R181.1 U22.10(Collector)
NetR171_2: R171.2 U22.1(Anode)
NetR173_1: R173.1 U22.15(Emitter)
NetR174_2: R174.2 U22.3(Anode)
NetR176_1: R176.1 U22.13(Emitter)
NetR177_2: R177.2 U22.5(Anode)
NetR179_1: R179.1 U22.11(Emitter)
NetR180_2: R180.2 U22.7(Anode)
NetR182_1: R182.1 U22.9(Emitter)
NetR183_2: R183.2 U23.16(Collector)
NetR184_2: R184.2 U23.15(Emitter)
NetR185_1: R185.1 U23.2(Cathode)
NetR186_2: R186.2 U23.14(Collector)
NetR187_2: R187.2 U23.13(Emitter)
NetR188_1: R188.1 U23.4(Cathode)
NetR189_2: R189.2 U23.12(Collector)
NetR190_2: R190.2 U23.11(Emitter)
NetR191_1: R191.1 U23.6(Cathode)
NetR192_2: R192.2 U23.10(Collector)
NetR193_2: R193.2 U23.9(Emitter)
NetR194_1: R194.1 U23.8(Cathode)

### Library data of the parts
R167-R194 = Res1: Resistor; Published: 8-Jun-2000; LatestRevisionDate: 17-Jul-2002; LatestRevisionNote: Re-released for DXP Platform.; PackageReference: AXIAL-0.3; Publisher: Altium Limited; PackageDescription: Axial Device, Thru-Hole; 2 Leads; 0.3 in Pin Spacing

## Sheet DSP_GPIO_Part2.SchDoc
size A4
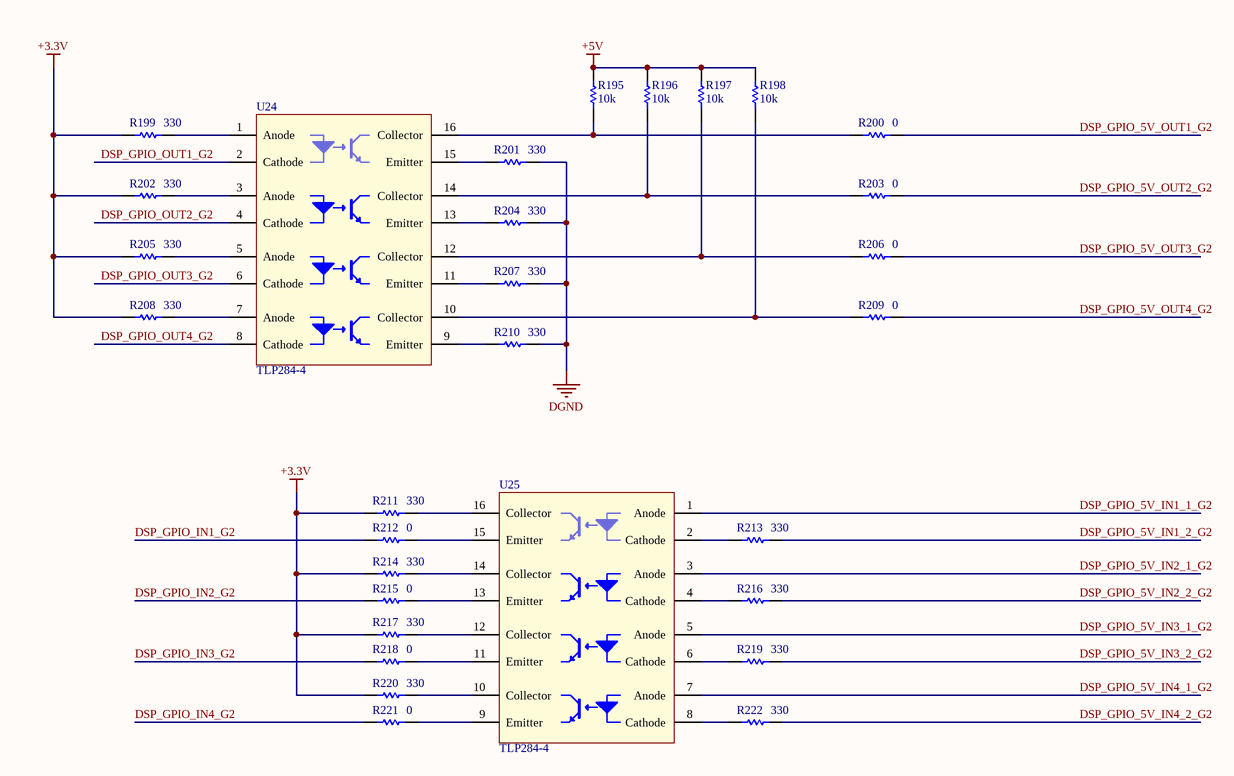
[diagram p5: DSP_GPIO_Part2.SchDoc]

### Parts
R195  value 10k  [1608[0603]]  (hidden comment: Res1)
R196  value 10k  [1608[0603]]  (hidden comment: Res1)
R197  value 10k  [1608[0603]]  (hidden comment: Res1)
R198  value 10k  [1608[0603]]  (hidden comment: Res1)
R199  value 330  [1608[0603]]  (hidden comment: Res1)
R200  value 0  [1608[0603]]  (hidden comment: Res1)
R201  value 330  [1608[0603]]  (hidden comment: Res1)
R202  value 330  [1608[0603]]  (hidden comment: Res1)
R203  value 0  [1608[0603]]  (hidden comment: Res1)
R204  value 330  [1608[0603]]  (hidden comment: Res1)
R205  value 330  [1608[0603]]  (hidden comment: Res1)
R206  value 0  [1608[0603]]  (hidden comment: Res1)
R207  value 330  [1608[0603]]  (hidden comment: Res1)
R208  value 330  [1608[0603]]  (hidden comment: Res1)
R209  value 0  [1608[0603]]  (hidden comment: Res1)
R210  value 330  [1608[0603]]  (hidden comment: Res1)
R211  value 330  [1608[0603]]  (hidden comment: Res1)
R212  value 0  [1608[0603]]  (hidden comment: Res1)
R213  value 330  [1608[0603]]  (hidden comment: Res1)
R214  value 330  [1608[0603]]  (hidden comment: Res1)
R215  value 0  [1608[0603]]  (hidden comment: Res1)
R216  value 330  [1608[0603]]  (hidden comment: Res1)
R217  value 330  [1608[0603]]  (hidden comment: Res1)
R218  value 0  [1608[0603]]  (hidden comment: Res1)
R219  value 330  [1608[0603]]  (hidden comment: Res1)
R220  value 330  [1608[0603]]  (hidden comment: Res1)
R221  value 0  [1608[0603]]  (hidden comment: Res1)
R222  value 330  [1608[0603]]  (hidden comment: Res1)
U24  TLP284-4  [TLP284-4]
U25  TLP284-4  [TLP284-4]

### Nets
+3.3V: R199.1 R202.1 R205.1 R208.1 R211.1 R214.1 R217.1 R220.1
+5V: R195.2 R196.2 R197.2 R198.2
DGND: R201.2 R204.2 R207.2 R210.2
DSP_GPIO_5V_IN1_1_G2: U25.1(Anode)
DSP_GPIO_5V_IN1_2_G2: R213.2
DSP_GPIO_5V_IN2_1_G2: U25.3(Anode)
DSP_GPIO_5V_IN2_2_G2: R216.2
DSP_GPIO_5V_IN3_1_G2: U25.5(Anode)
DSP_GPIO_5V_IN3_2_G2: R219.2
DSP_GPIO_5V_IN4_1_G2: U25.7(Anode)
DSP_GPIO_5V_IN4_2_G2: R222.2
DSP_GPIO_5V_OUT1_G2: R200.2
DSP_GPIO_5V_OUT2_G2: R203.2
DSP_GPIO_5V_OUT3_G2: R206.2
DSP_GPIO_5V_OUT4_G2: R209.2
DSP_GPIO_IN1_G2: R212.1
DSP_GPIO_IN2_G2: R215.1
DSP_GPIO_IN3_G2: R218.1
DSP_GPIO_IN4_G2: R221.1
DSP_GPIO_OUT1_G2: U24.2(Cathode)
DSP_GPIO_OUT2_G2: U24.4(Cathode)
DSP_GPIO_OUT3_G2: U24.6(Cathode)
DSP_GPIO_OUT4_G2: U24.8(Cathode)
NetR195_1: R195.1 R200.1 U24.16(Collector)
NetR196_1: R196.1 R203.1 U24.14(Collector)
NetR197_1: R197.1 R206.1 U24.12(Collector)
NetR198_1: R198.1 R209.1 U24.10(Collector)
NetR199_2: R199.2 U24.1(Anode)
NetR201_1: R201.1 U24.15(Emitter)
NetR202_2: R202.2 U24.3(Anode)
NetR204_1: R204.1 U24.13(Emitter)
NetR205_2: R205.2 U24.5(Anode)
NetR207_1: R207.1 U24.11(Emitter)
NetR208_2: R208.2 U24.7(Anode)
NetR210_1: R210.1 U24.9(Emitter)
NetR211_2: R211.2 U25.16(Collector)
NetR212_2: R212.2 U25.15(Emitter)
NetR213_1: R213.1 U25.2(Cathode)
NetR214_2: R214.2 U25.14(Collector)
NetR215_2: R215.2 U25.13(Emitter)
NetR216_1: R216.1 U25.4(Cathode)
NetR217_2: R217.2 U25.12(Collector)
NetR218_2: R218.2 U25.11(Emitter)
NetR219_1: R219.1 U25.6(Cathode)
NetR220_2: R220.2 U25.10(Collector)
NetR221_2: R221.2 U25.9(Emitter)
NetR222_1: R222.1 U25.8(Cathode)

### Library data of the parts
R195-R222 = Res1: Resistor; Published: 8-Jun-2000; LatestRevisionDate: 17-Jul-2002; LatestRevisionNote: Re-released for DXP Platform.; PackageReference: AXIAL-0.3; Publisher: Altium Limited; PackageDescription: Axial Device, Thru-Hole; 2 Leads; 0.3 in Pin Spacing

## Sheet DSP_GPIO_Part3.SchDoc
size A4
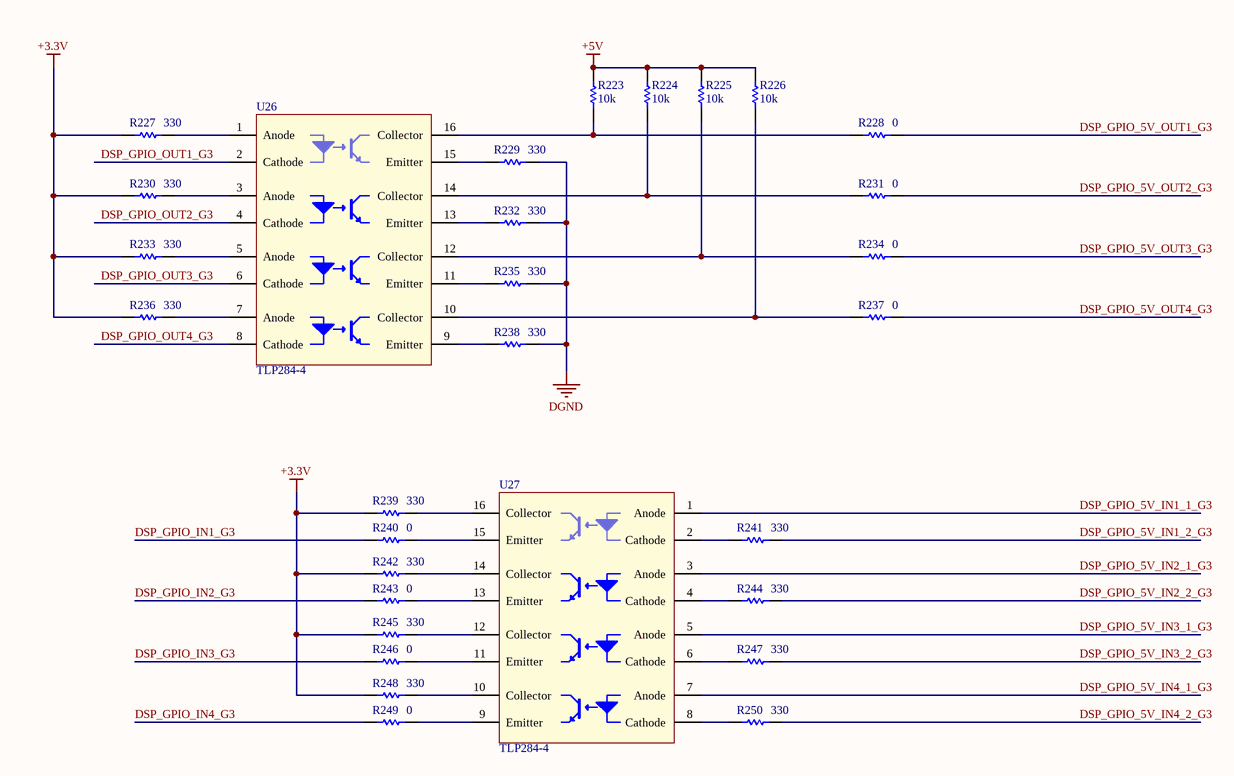
[diagram p6: DSP_GPIO_Part3.SchDoc]

### Parts
R223  value 10k  [1608[0603]]  (hidden comment: Res1)
R224  value 10k  [1608[0603]]  (hidden comment: Res1)
R225  value 10k  [1608[0603]]  (hidden comment: Res1)
R226  value 10k  [1608[0603]]  (hidden comment: Res1)
R227  value 330  [1608[0603]]  (hidden comment: Res1)
R228  value 0  [1608[0603]]  (hidden comment: Res1)
R229  value 330  [1608[0603]]  (hidden comment: Res1)
R230  value 330  [1608[0603]]  (hidden comment: Res1)
R231  value 0  [1608[0603]]  (hidden comment: Res1)
R232  value 330  [1608[0603]]  (hidden comment: Res1)
R233  value 330  [1608[0603]]  (hidden comment: Res1)
R234  value 0  [1608[0603]]  (hidden comment: Res1)
R235  value 330  [1608[0603]]  (hidden comment: Res1)
R236  value 330  [1608[0603]]  (hidden comment: Res1)
R237  value 0  [1608[0603]]  (hidden comment: Res1)
R238  value 330  [1608[0603]]  (hidden comment: Res1)
R239  value 330  [1608[0603]]  (hidden comment: Res1)
R240  value 0  [1608[0603]]  (hidden comment: Res1)
R241  value 330  [1608[0603]]  (hidden comment: Res1)
R242  value 330  [1608[0603]]  (hidden comment: Res1)
R243  value 0  [1608[0603]]  (hidden comment: Res1)
R244  value 330  [1608[0603]]  (hidden comment: Res1)
R245  value 330  [1608[0603]]  (hidden comment: Res1)
R246  value 0  [1608[0603]]  (hidden comment: Res1)
R247  value 330  [1608[0603]]  (hidden comment: Res1)
R248  value 330  [1608[0603]]  (hidden comment: Res1)
R249  value 0  [1608[0603]]  (hidden comment: Res1)
R250  value 330  [1608[0603]]  (hidden comment: Res1)
U26  TLP284-4  [TLP284-4]
U27  TLP284-4  [TLP284-4]

### Nets
+3.3V: R227.1 R230.1 R233.1 R236.1 R239.1 R242.1 R245.1 R248.1
+5V: R223.2 R224.2 R225.2 R226.2
DGND: R229.2 R232.2 R235.2 R238.2
DSP_GPIO_5V_IN1_1_G3: U27.1(Anode)
DSP_GPIO_5V_IN1_2_G3: R241.2
DSP_GPIO_5V_IN2_1_G3: U27.3(Anode)
DSP_GPIO_5V_IN2_2_G3: R244.2
DSP_GPIO_5V_IN3_1_G3: U27.5(Anode)
DSP_GPIO_5V_IN3_2_G3: R247.2
DSP_GPIO_5V_IN4_1_G3: U27.7(Anode)
DSP_GPIO_5V_IN4_2_G3: R250.2
DSP_GPIO_5V_OUT1_G3: R228.2
DSP_GPIO_5V_OUT2_G3: R231.2
DSP_GPIO_5V_OUT3_G3: R234.2
DSP_GPIO_5V_OUT4_G3: R237.2
DSP_GPIO_IN1_G3: R240.1
DSP_GPIO_IN2_G3: R243.1
DSP_GPIO_IN3_G3: R246.1
DSP_GPIO_IN4_G3: R249.1
DSP_GPIO_OUT1_G3: U26.2(Cathode)
DSP_GPIO_OUT2_G3: U26.4(Cathode)
DSP_GPIO_OUT3_G3: U26.6(Cathode)
DSP_GPIO_OUT4_G3: U26.8(Cathode)
NetR223_1: R223.1 R228.1 U26.16(Collector)
NetR224_1: R224.1 R231.1 U26.14(Collector)
NetR225_1: R225.1 R234.1 U26.12(Collector)
NetR226_1: R226.1 R237.1 U26.10(Collector)
NetR227_2: R227.2 U26.1(Anode)
NetR229_1: R229.1 U26.15(Emitter)
NetR230_2: R230.2 U26.3(Anode)
NetR232_1: R232.1 U26.13(Emitter)
NetR233_2: R233.2 U26.5(Anode)
NetR235_1: R235.1 U26.11(Emitter)
NetR236_2: R236.2 U26.7(Anode)
NetR238_1: R238.1 U26.9(Emitter)
NetR239_2: R239.2 U27.16(Collector)
NetR240_2: R240.2 U27.15(Emitter)
NetR241_1: R241.1 U27.2(Cathode)
NetR242_2: R242.2 U27.14(Collector)
NetR243_2: R243.2 U27.13(Emitter)
NetR244_1: R244.1 U27.4(Cathode)
NetR245_2: R245.2 U27.12(Collector)
NetR246_2: R246.2 U27.11(Emitter)
NetR247_1: R247.1 U27.6(Cathode)
NetR248_2: R248.2 U27.10(Collector)
NetR249_2: R249.2 U27.9(Emitter)
NetR250_1: R250.1 U27.8(Cathode)

### Library data of the parts
R223-R250 = Res1: Resistor; Published: 8-Jun-2000; LatestRevisionDate: 17-Jul-2002; LatestRevisionNote: Re-released for DXP Platform.; PackageReference: AXIAL-0.3; Publisher: Altium Limited; PackageDescription: Axial Device, Thru-Hole; 2 Leads; 0.3 in Pin Spacing

## Sheet DSP_GPIO_Part4.SchDoc
size A4
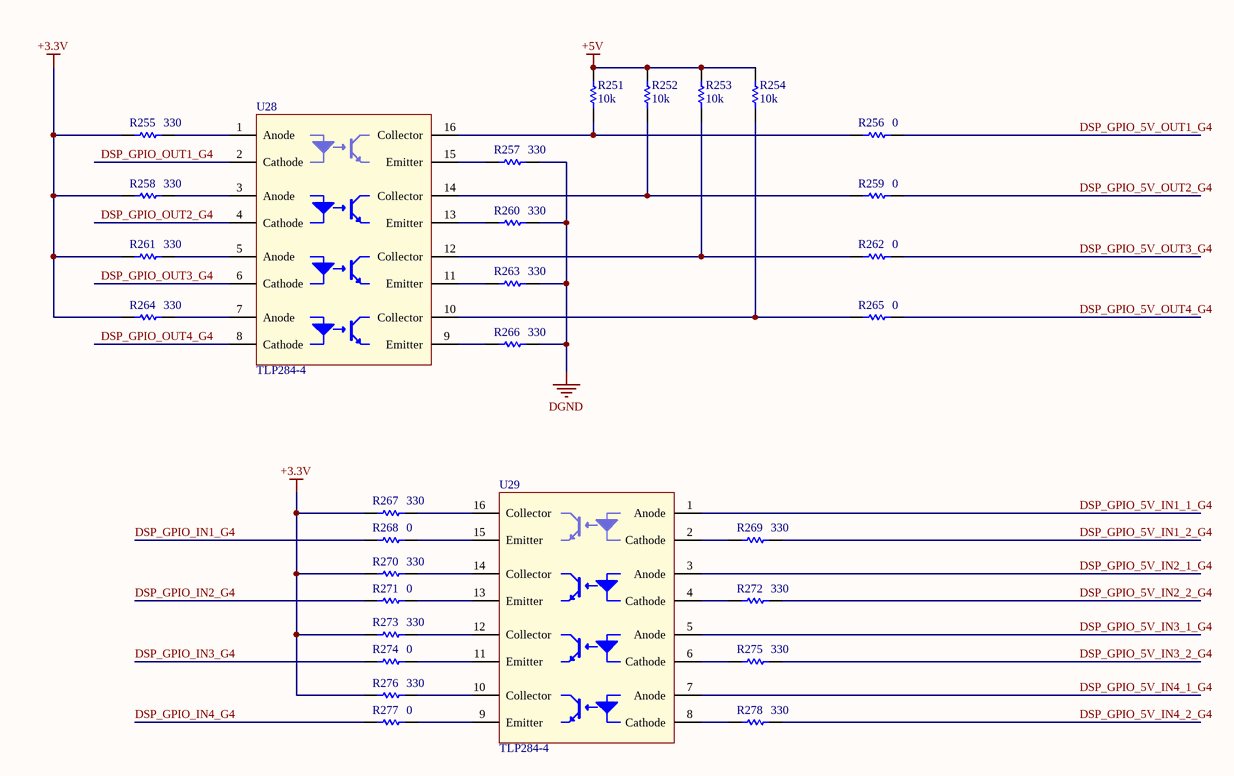
[diagram p7: DSP_GPIO_Part4.SchDoc]

### Parts
R251  value 10k  [1608[0603]]  (hidden comment: Res1)
R252  value 10k  [1608[0603]]  (hidden comment: Res1)
R253  value 10k  [1608[0603]]  (hidden comment: Res1)
R254  value 10k  [1608[0603]]  (hidden comment: Res1)
R255  value 330  [1608[0603]]  (hidden comment: Res1)
R256  value 0  [1608[0603]]  (hidden comment: Res1)
R257  value 330  [1608[0603]]  (hidden comment: Res1)
R258  value 330  [1608[0603]]  (hidden comment: Res1)
R259  value 0  [1608[0603]]  (hidden comment: Res1)
R260  value 330  [1608[0603]]  (hidden comment: Res1)
R261  value 330  [1608[0603]]  (hidden comment: Res1)
R262  value 0  [1608[0603]]  (hidden comment: Res1)
R263  value 330  [1608[0603]]  (hidden comment: Res1)
R264  value 330  [1608[0603]]  (hidden comment: Res1)
R265  value 0  [1608[0603]]  (hidden comment: Res1)
R266  value 330  [1608[0603]]  (hidden comment: Res1)
R267  value 330  [1608[0603]]  (hidden comment: Res1)
R268  value 0  [1608[0603]]  (hidden comment: Res1)
R269  value 330  [1608[0603]]  (hidden comment: Res1)
R270  value 330  [1608[0603]]  (hidden comment: Res1)
R271  value 0  [1608[0603]]  (hidden comment: Res1)
R272  value 330  [1608[0603]]  (hidden comment: Res1)
R273  value 330  [1608[0603]]  (hidden comment: Res1)
R274  value 0  [1608[0603]]  (hidden comment: Res1)
R275  value 330  [1608[0603]]  (hidden comment: Res1)
R276  value 330  [1608[0603]]  (hidden comment: Res1)
R277  value 0  [1608[0603]]  (hidden comment: Res1)
R278  value 330  [1608[0603]]  (hidden comment: Res1)
U28  TLP284-4  [TLP284-4]
U29  TLP284-4  [TLP284-4]

### Nets
+3.3V: R255.1 R258.1 R261.1 R264.1 R267.1 R270.1 R273.1 R276.1
+5V: R251.2 R252.2 R253.2 R254.2
DGND: R257.2 R260.2 R263.2 R266.2
DSP_GPIO_5V_IN1_1_G4: U29.1(Anode)
DSP_GPIO_5V_IN1_2_G4: R269.2
DSP_GPIO_5V_IN2_1_G4: U29.3(Anode)
DSP_GPIO_5V_IN2_2_G4: R272.2
DSP_GPIO_5V_IN3_1_G4: U29.5(Anode)
DSP_GPIO_5V_IN3_2_G4: R275.2
DSP_GPIO_5V_IN4_1_G4: U29.7(Anode)
DSP_GPIO_5V_IN4_2_G4: R278.2
DSP_GPIO_5V_OUT1_G4: R256.2
DSP_GPIO_5V_OUT2_G4: R259.2
DSP_GPIO_5V_OUT3_G4: R262.2
DSP_GPIO_5V_OUT4_G4: R265.2
DSP_GPIO_IN1_G4: R268.1
DSP_GPIO_IN2_G4: R271.1
DSP_GPIO_IN3_G4: R274.1
DSP_GPIO_IN4_G4: R277.1
DSP_GPIO_OUT1_G4: U28.2(Cathode)
DSP_GPIO_OUT2_G4: U28.4(Cathode)
DSP_GPIO_OUT3_G4: U28.6(Cathode)
DSP_GPIO_OUT4_G4: U28.8(Cathode)
NetR251_1: R251.1 R256.1 U28.16(Collector)
NetR252_1: R252.1 R259.1 U28.14(Collector)
NetR253_1: R253.1 R262.1 U28.12(Collector)
NetR254_1: R254.1 R265.1 U28.10(Collector)
NetR255_2: R255.2 U28.1(Anode)
NetR257_1: R257.1 U28.15(Emitter)
NetR258_2: R258.2 U28.3(Anode)
NetR260_1: R260.1 U28.13(Emitter)
NetR261_2: R261.2 U28.5(Anode)
NetR263_1: R263.1 U28.11(Emitter)
NetR264_2: R264.2 U28.7(Anode)
NetR266_1: R266.1 U28.9(Emitter)
NetR267_2: R267.2 U29.16(Collector)
NetR268_2: R268.2 U29.15(Emitter)
NetR269_1: R269.1 U29.2(Cathode)
NetR270_2: R270.2 U29.14(Collector)
NetR271_2: R271.2 U29.13(Emitter)
NetR272_1: R272.1 U29.4(Cathode)
NetR273_2: R273.2 U29.12(Collector)
NetR274_2: R274.2 U29.11(Emitter)
NetR275_1: R275.1 U29.6(Cathode)
NetR276_2: R276.2 U29.10(Collector)
NetR277_2: R277.2 U29.9(Emitter)
NetR278_1: R278.1 U29.8(Cathode)

### Library data of the parts
R251-R278 = Res1: Resistor; Published: 8-Jun-2000; LatestRevisionDate: 17-Jul-2002; LatestRevisionNote: Re-released for DXP Platform.; PackageReference: AXIAL-0.3; Publisher: Altium Limited; PackageDescription: Axial Device, Thru-Hole; 2 Leads; 0.3 in Pin Spacing

## Sheet Enconder_Part1.SchDoc
size A4
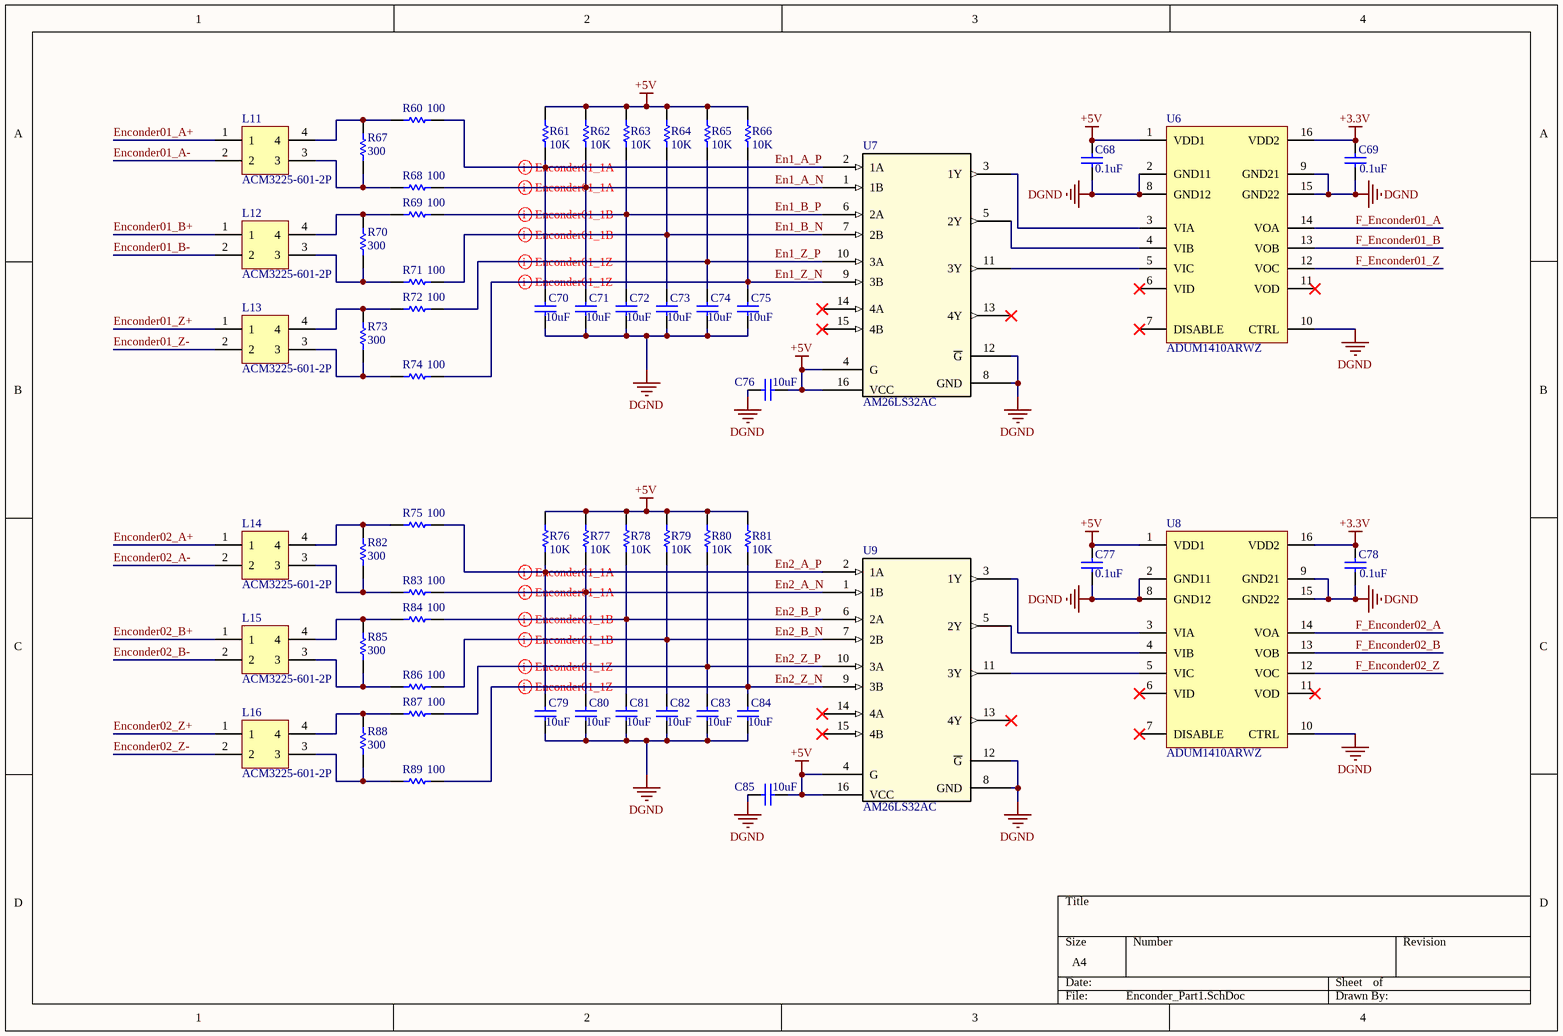
[diagram p8: Enconder_Part1.SchDoc]

### Parts
C68  value 0.1uF  [1608[0603]]  (hidden comment: Cap)
C69  value 0.1uF  [1608[0603]]  (hidden comment: Cap)
C70  value 10uF  [1608[0603]]  (hidden comment: Cap)
C71  value 10uF  [1608[0603]]  (hidden comment: Cap)
C72  value 10uF  [1608[0603]]  (hidden comment: Cap)
C73  value 10uF  [1608[0603]]  (hidden comment: Cap)
C74  value 10uF  [1608[0603]]  (hidden comment: Cap)
C75  value 10uF  [1608[0603]]  (hidden comment: Cap)
C76  value 10uF  [1608[0603]]  (hidden comment: Cap)
C77  value 0.1uF  [1608[0603]]  (hidden comment: Cap)
C78  value 0.1uF  [1608[0603]]  (hidden comment: Cap)
C79  value 10uF  [1608[0603]]  (hidden comment: Cap)
C80  value 10uF  [1608[0603]]  (hidden comment: Cap)
C81  value 10uF  [1608[0603]]  (hidden comment: Cap)
C82  value 10uF  [1608[0603]]  (hidden comment: Cap)
C83  value 10uF  [1608[0603]]  (hidden comment: Cap)
C84  value 10uF  [1608[0603]]  (hidden comment: Cap)
C85  value 10uF  [1608[0603]]  (hidden comment: Cap)
L11  ACM3225-601-2P  [ACM3225-601-2P]
L12  ACM3225-601-2P  [ACM3225-601-2P]
L13  ACM3225-601-2P  [ACM3225-601-2P]
L14  ACM3225-601-2P  [ACM3225-601-2P]
L15  ACM3225-601-2P  [ACM3225-601-2P]
L16  ACM3225-601-2P  [ACM3225-601-2P]
R60  value 100  [1608[0603]]  (hidden comment: Res1)
R61  value 10K  [1608[0603]]  (hidden comment: Res1)
R62  value 10K  [1608[0603]]  (hidden comment: Res1)
R63  value 10K  [1608[0603]]  (hidden comment: Res1)
R64  value 10K  [1608[0603]]  (hidden comment: Res1)
R65  value 10K  [1608[0603]]  (hidden comment: Res1)
R66  value 10K  [1608[0603]]  (hidden comment: Res1)
R67  value 300  [1608[0603]]  (hidden comment: Res1)
R68  value 100  [1608[0603]]  (hidden comment: Res1)
R69  value 100  [1608[0603]]  (hidden comment: Res1)
R70  value 300  [1608[0603]]  (hidden comment: Res1)
R71  value 100  [1608[0603]]  (hidden comment: Res1)
R72  value 100  [1608[0603]]  (hidden comment: Res1)
R73  value 300  [1608[0603]]  (hidden comment: Res1)
R74  value 100  [1608[0603]]  (hidden comment: Res1)
R75  value 100  [1608[0603]]  (hidden comment: Res1)
R76  value 10K  [1608[0603]]  (hidden comment: Res1)
R77  value 10K  [1608[0603]]  (hidden comment: Res1)
R78  value 10K  [1608[0603]]  (hidden comment: Res1)
R79  value 10K  [1608[0603]]  (hidden comment: Res1)
R80  value 10K  [1608[0603]]  (hidden comment: Res1)
R81  value 10K  [1608[0603]]  (hidden comment: Res1)
R82  value 300  [1608[0603]]  (hidden comment: Res1)
R83  value 100  [1608[0603]]  (hidden comment: Res1)
R84  value 100  [1608[0603]]  (hidden comment: Res1)
R85  value 300  [1608[0603]]  (hidden comment: Res1)
R86  value 100  [1608[0603]]  (hidden comment: Res1)
R87  value 100  [1608[0603]]  (hidden comment: Res1)
R88  value 300  [1608[0603]]  (hidden comment: Res1)
R89  value 100  [1608[0603]]  (hidden comment: Res1)
U6  ADUM1410ARWZ  [ADUM1410ARWZ_SOIC]
U7  AM26LS32AC  [AM26LS32AC_SOP]
U8  ADUM1410ARWZ  [ADUM1410ARWZ_SOIC]
U9  AM26LS32AC  [AM26LS32AC_SOP]

### Nets
+3.3V: C69.2 C78.2 U6.16(VDD2) U8.16(VDD2)
+5V: C68.2 C76.1 C77.2 C85.1 R61.2 R62.2 R63.2 R64.2 R65.2 R66.2 R76.2 R77.2 R78.2 R79.2 R80.2 R81.2 U6.1(VDD1) U7.4(G) U7.16(VCC) U8.1(VDD1) U9.4(G) U9.16(VCC)
DGND: C68.1 C69.1 C70.1 C71.1 C72.1 C73.1 C74.1 C75.1 C76.2 C77.1 C78.1 C79.1 C80.1 C81.1 C82.1 C83.1 C84.1 C85.2 U6.2(GND11) U6.8(GND12) U6.9(GND21) U6.10(CTRL) U6.15(GND22) U7.8(GND) U7.12(~{G}) U8.2(GND11) U8.8(GND12) U8.9(GND21) U8.10(CTRL) U8.15(GND22) U9.8(GND) U9.12(~{G})
En1_A_N: C71.2 R62.1 R68.2 U7.1(1B)
En1_A_P: C70.2 R60.2 R61.1 U7.2(1A)
En1_B_N: C73.2 R64.1 R71.2 U7.7(2B)
En1_B_P: C72.2 R63.1 R69.2 U7.6(2A)
En1_Z_N: C75.2 R66.1 R74.2 U7.9(3B)
En1_Z_P: C74.2 R65.1 R72.2 U7.10(3A)
En2_A_N: C80.2 R77.1 R83.2 U9.1(1B)
En2_A_P: C79.2 R75.2 R76.1 U9.2(1A)
En2_B_N: C82.2 R79.1 R86.2 U9.7(2B)
En2_B_P: C81.2 R78.1 R84.2 U9.6(2A)
En2_Z_N: C84.2 R81.1 R89.2 U9.9(3B)
En2_Z_P: C83.2 R80.1 R87.2 U9.10(3A)
Enconder01_A+: L11.1
Enconder01_A-: L11.2
Enconder01_B+: L12.1
Enconder01_B-: L12.2
Enconder01_Z+: L13.1
Enconder01_Z-: L13.2
Enconder02_A+: L14.1
Enconder02_A-: L14.2
Enconder02_B+: L15.1
Enconder02_B-: L15.2
Enconder02_Z+: L16.1
Enconder02_Z-: L16.2
F_Enconder01_A: U6.14(VOA)
F_Enconder01_B: U6.13(VOB)
F_Enconder01_Z: U6.12(VOC)
F_Enconder02_A: U8.14(VOA)
F_Enconder02_B: U8.13(VOB)
F_Enconder02_Z: U8.12(VOC)
NetL11_3: L11.3 R67.1 R68.1
NetL11_4: L11.4 R60.1 R67.2
NetL12_3: L12.3 R70.1 R71.1
NetL12_4: L12.4 R69.1 R70.2
NetL13_3: L13.3 R73.1 R74.1
NetL13_4: L13.4 R72.1 R73.2
NetL14_3: L14.3 R82.1 R83.1
NetL14_4: L14.4 R75.1 R82.2
NetL15_3: L15.3 R85.1 R86.1
NetL15_4: L15.4 R84.1 R85.2
NetL16_3: L16.3 R88.1 R89.1
NetL16_4: L16.4 R87.1 R88.2
NetU6_3: U6.3(VIA) U7.3(1Y)
NetU6_4: U6.4(VIB) U7.5(2Y)
NetU6_5: U6.5(VIC) U7.11(3Y)
NetU8_3: U8.3(VIA) U9.3(1Y)
NetU8_4: U8.4(VIB) U9.5(2Y)
NetU8_5: U8.5(VIC) U9.11(3Y)

Not connected (* = marked no-connect by the designer): U6 6(VID)* 7(DISABLE)* 11(VOD)*; U7 13(4Y)* 14(4A)* 15(4B)*; U8 6(VID)* 7(DISABLE)* 11(VOD)*; U9 13(4Y)* 14(4A)* 15(4B)*

### Layout directives
differential pair: En1_A_N, En1_A_P, En1_B_N, En1_B_P, En1_Z_N, En1_Z_P, En2_A_N, En2_A_P, En2_B_N, En2_B_P, En2_Z_N, En2_Z_P

### Library data of the parts
C68-C85 = Cap: Capacitor; Published: 8-Jun-2000; LatestRevisionDate: 17-Jul-2002; LatestRevisionNote: Re-released for DXP Platform.; PackageReference: RAD-0.3; Publisher: Altium Limited; PackageDescription: Radial Cap, Thru-Hole; 2 Leads; 0.3 in Pin Spacing
R60-R89 = Res1: Resistor; Published: 8-Jun-2000; LatestRevisionDate: 17-Jul-2002; LatestRevisionNote: Re-released for DXP Platform.; PackageReference: AXIAL-0.3; Publisher: Altium Limited; PackageDescription: Axial Device, Thru-Hole; 2 Leads; 0.3 in Pin Spacing

## Sheet Enconder_Part2.SchDoc
size A4
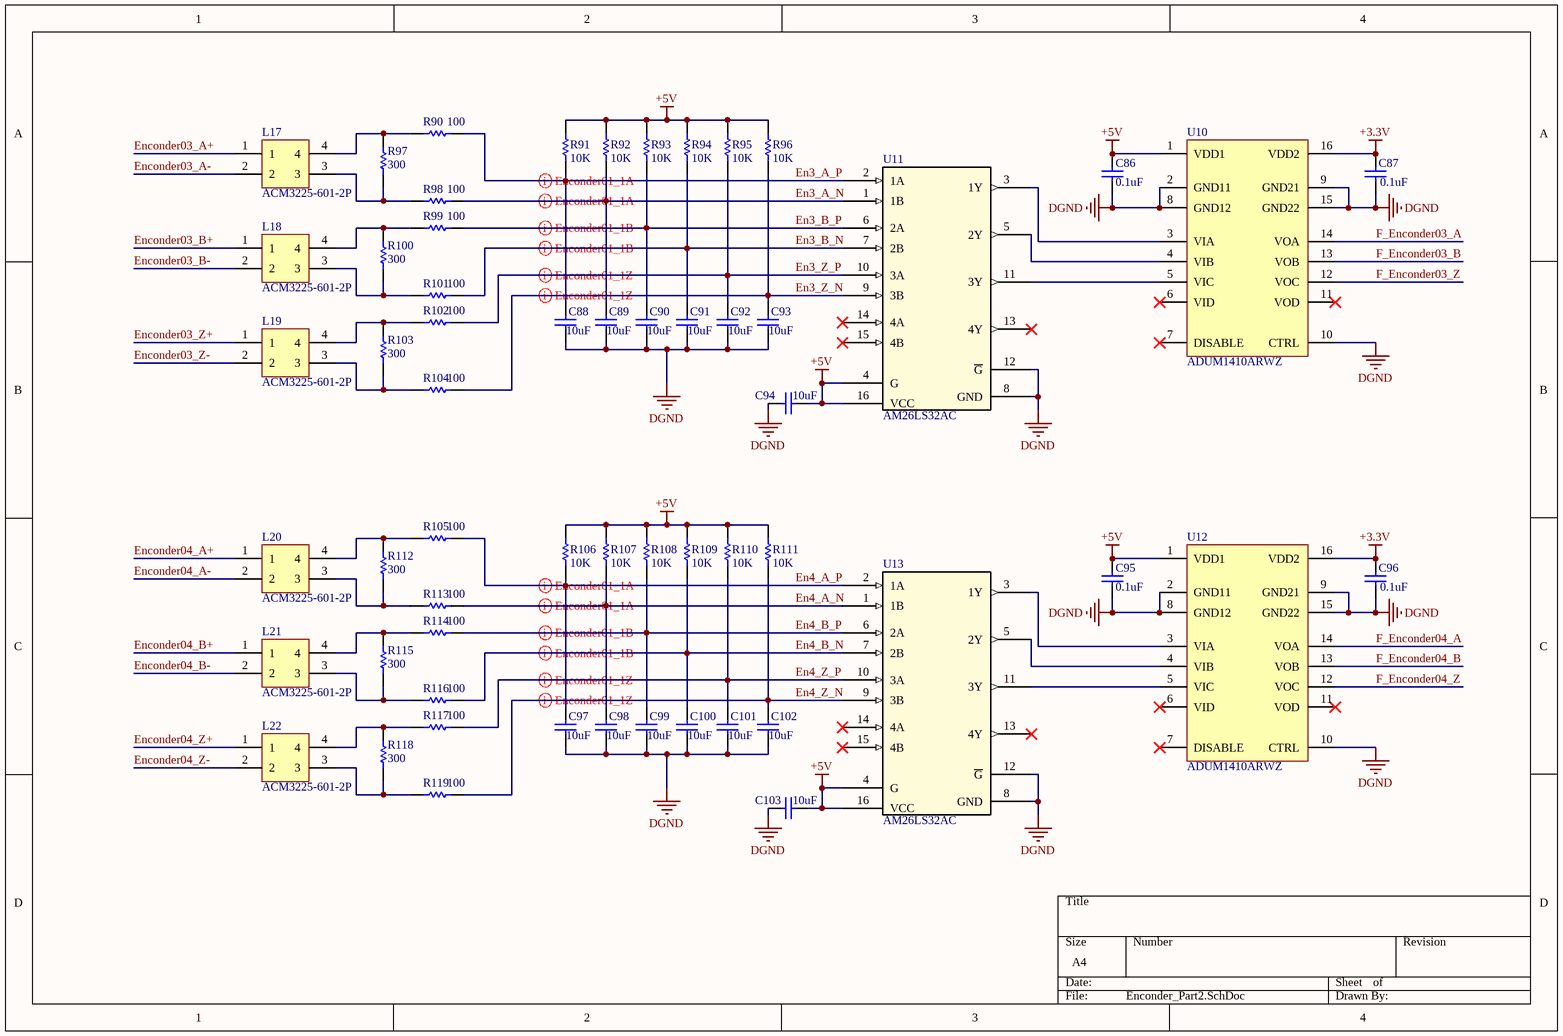
[diagram p9: Enconder_Part2.SchDoc]

### Parts
C86  value 0.1uF  [1608[0603]]  (hidden comment: Cap)
C87  value 0.1uF  [1608[0603]]  (hidden comment: Cap)
C88  value 10uF  [1608[0603]]  (hidden comment: Cap)
C89  value 10uF  [1608[0603]]  (hidden comment: Cap)
C90  value 10uF  [1608[0603]]  (hidden comment: Cap)
C91  value 10uF  [1608[0603]]  (hidden comment: Cap)
C92  value 10uF  [1608[0603]]  (hidden comment: Cap)
C93  value 10uF  [1608[0603]]  (hidden comment: Cap)
C94  value 10uF  [1608[0603]]  (hidden comment: Cap)
C95  value 0.1uF  [1608[0603]]  (hidden comment: Cap)
C96  value 0.1uF  [1608[0603]]  (hidden comment: Cap)
C97  value 10uF  [1608[0603]]  (hidden comment: Cap)
C98  value 10uF  [1608[0603]]  (hidden comment: Cap)
C99  value 10uF  [1608[0603]]  (hidden comment: Cap)
C100  value 10uF  [1608[0603]]  (hidden comment: Cap)
C101  value 10uF  [1608[0603]]  (hidden comment: Cap)
C102  value 10uF  [1608[0603]]  (hidden comment: Cap)
C103  value 10uF  [1608[0603]]  (hidden comment: Cap)
L17  ACM3225-601-2P  [ACM3225-601-2P]
L18  ACM3225-601-2P  [ACM3225-601-2P]
L19  ACM3225-601-2P  [ACM3225-601-2P]
L20  ACM3225-601-2P  [ACM3225-601-2P]
L21  ACM3225-601-2P  [ACM3225-601-2P]
L22  ACM3225-601-2P  [ACM3225-601-2P]
R90  value 100  [1608[0603]]  (hidden comment: Res1)
R91  value 10K  [1608[0603]]  (hidden comment: Res1)
R92  value 10K  [1608[0603]]  (hidden comment: Res1)
R93  value 10K  [1608[0603]]  (hidden comment: Res1)
R94  value 10K  [1608[0603]]  (hidden comment: Res1)
R95  value 10K  [1608[0603]]  (hidden comment: Res1)
R96  value 10K  [1608[0603]]  (hidden comment: Res1)
R97  value 300  [1608[0603]]  (hidden comment: Res1)
R98  value 100  [1608[0603]]  (hidden comment: Res1)
R99  value 100  [1608[0603]]  (hidden comment: Res1)
R100  value 300  [1608[0603]]  (hidden comment: Res1)
R101  value 100  [1608[0603]]  (hidden comment: Res1)
R102  value 100  [1608[0603]]  (hidden comment: Res1)
R103  value 300  [1608[0603]]  (hidden comment: Res1)
R104  value 100  [1608[0603]]  (hidden comment: Res1)
R105  value 100  [1608[0603]]  (hidden comment: Res1)
R106  value 10K  [1608[0603]]  (hidden comment: Res1)
R107  value 10K  [1608[0603]]  (hidden comment: Res1)
R108  value 10K  [1608[0603]]  (hidden comment: Res1)
R109  value 10K  [1608[0603]]  (hidden comment: Res1)
R110  value 10K  [1608[0603]]  (hidden comment: Res1)
R111  value 10K  [1608[0603]]  (hidden comment: Res1)
R112  value 300  [1608[0603]]  (hidden comment: Res1)
R113  value 100  [1608[0603]]  (hidden comment: Res1)
R114  value 100  [1608[0603]]  (hidden comment: Res1)
R115  value 300  [1608[0603]]  (hidden comment: Res1)
R116  value 100  [1608[0603]]  (hidden comment: Res1)
R117  value 100  [1608[0603]]  (hidden comment: Res1)
R118  value 300  [1608[0603]]  (hidden comment: Res1)
R119  value 100  [1608[0603]]  (hidden comment: Res1)
U10  ADUM1410ARWZ  [ADUM1410ARWZ_SOIC]
U11  AM26LS32AC  [AM26LS32AC_SOP]
U12  ADUM1410ARWZ  [ADUM1410ARWZ_SOIC]
U13  AM26LS32AC  [AM26LS32AC_SOP]

### Nets
+3.3V: C87.2 C96.2 U10.16(VDD2) U12.16(VDD2)
+5V: C86.2 C94.1 C95.2 C103.1 R91.2 R92.2 R93.2 R94.2 R95.2 R96.2 R106.2 R107.2 R108.2 R109.2 R110.2 R111.2 U10.1(VDD1) U11.4(G) U11.16(VCC) U12.1(VDD1) U13.4(G) U13.16(VCC)
DGND: C86.1 C87.1 C88.1 C89.1 C90.1 C91.1 C92.1 C93.1 C94.2 C95.1 C96.1 C97.1 C98.1 C99.1 C100.1 C101.1 C102.1 C103.2 U10.2(GND11) U10.8(GND12) U10.9(GND21) U10.10(CTRL) U10.15(GND22) U11.8(GND) U11.12(~{G}) U12.2(GND11) U12.8(GND12) U12.9(GND21) U12.10(CTRL) U12.15(GND22) U13.8(GND) U13.12(~{G})
En3_A_N: C89.2 R92.1 R98.2 U11.1(1B)
En3_A_P: C88.2 R90.2 R91.1 U11.2(1A)
En3_B_N: C91.2 R94.1 R101.2 U11.7(2B)
En3_B_P: C90.2 R93.1 R99.2 U11.6(2A)
En3_Z_N: C93.2 R96.1 R104.2 U11.9(3B)
En3_Z_P: C92.2 R95.1 R102.2 U11.10(3A)
En4_A_N: C98.2 R107.1 R113.2 U13.1(1B)
En4_A_P: C97.2 R105.2 R106.1 U13.2(1A)
En4_B_N: C100.2 R109.1 R116.2 U13.7(2B)
En4_B_P: C99.2 R108.1 R114.2 U13.6(2A)
En4_Z_N: C102.2 R111.1 R119.2 U13.9(3B)
En4_Z_P: C101.2 R110.1 R117.2 U13.10(3A)
Enconder03_A+: L17.1
Enconder03_A-: L17.2
Enconder03_B+: L18.1
Enconder03_B-: L18.2
Enconder03_Z+: L19.1
Enconder03_Z-: L19.2
Enconder04_A+: L20.1
Enconder04_A-: L20.2
Enconder04_B+: L21.1
Enconder04_B-: L21.2
Enconder04_Z+: L22.1
Enconder04_Z-: L22.2
F_Enconder03_A: U10.14(VOA)
F_Enconder03_B: U10.13(VOB)
F_Enconder03_Z: U10.12(VOC)
F_Enconder04_A: U12.14(VOA)
F_Enconder04_B: U12.13(VOB)
F_Enconder04_Z: U12.12(VOC)
NetL17_3: L17.3 R97.1 R98.1
NetL17_4: L17.4 R90.1 R97.2
NetL18_3: L18.3 R100.1 R101.1
NetL18_4: L18.4 R99.1 R100.2
NetL19_3: L19.3 R103.1 R104.1
NetL19_4: L19.4 R102.1 R103.2
NetL20_3: L20.3 R112.1 R113.1
NetL20_4: L20.4 R105.1 R112.2
NetL21_3: L21.3 R115.1 R116.1
NetL21_4: L21.4 R114.1 R115.2
NetL22_3: L22.3 R118.1 R119.1
NetL22_4: L22.4 R117.1 R118.2
NetU10_3: U10.3(VIA) U11.3(1Y)
NetU10_4: U10.4(VIB) U11.5(2Y)
NetU10_5: U10.5(VIC) U11.11(3Y)
NetU12_3: U12.3(VIA) U13.3(1Y)
NetU12_4: U12.4(VIB) U13.5(2Y)
NetU12_5: U12.5(VIC) U13.11(3Y)

Not connected (* = marked no-connect by the designer): U10 6(VID)* 7(DISABLE)* 11(VOD)*; U11 13(4Y)* 14(4A)* 15(4B)*; U12 6(VID)* 7(DISABLE)* 11(VOD)*; U13 13(4Y)* 14(4A)* 15(4B)*

### Layout directives
differential pair: En3_A_N, En3_A_P, En3_B_N, En3_B_P, En3_Z_N, En3_Z_P, En4_A_N, En4_A_P, En4_B_N, En4_B_P, En4_Z_N, En4_Z_P

### Library data of the parts
C86-C103 = Cap: Capacitor; Published: 8-Jun-2000; LatestRevisionDate: 17-Jul-2002; LatestRevisionNote: Re-released for DXP Platform.; PackageReference: RAD-0.3; Publisher: Altium Limited; PackageDescription: Radial Cap, Thru-Hole; 2 Leads; 0.3 in Pin Spacing
R90-R119 = Res1: Resistor; Published: 8-Jun-2000; LatestRevisionDate: 17-Jul-2002; LatestRevisionNote: Re-released for DXP Platform.; PackageReference: AXIAL-0.3; Publisher: Altium Limited; PackageDescription: Axial Device, Thru-Hole; 2 Leads; 0.3 in Pin Spacing